# EAGLE design A13-SOM-WIFI_Rev_B (EAGLE 4.16)
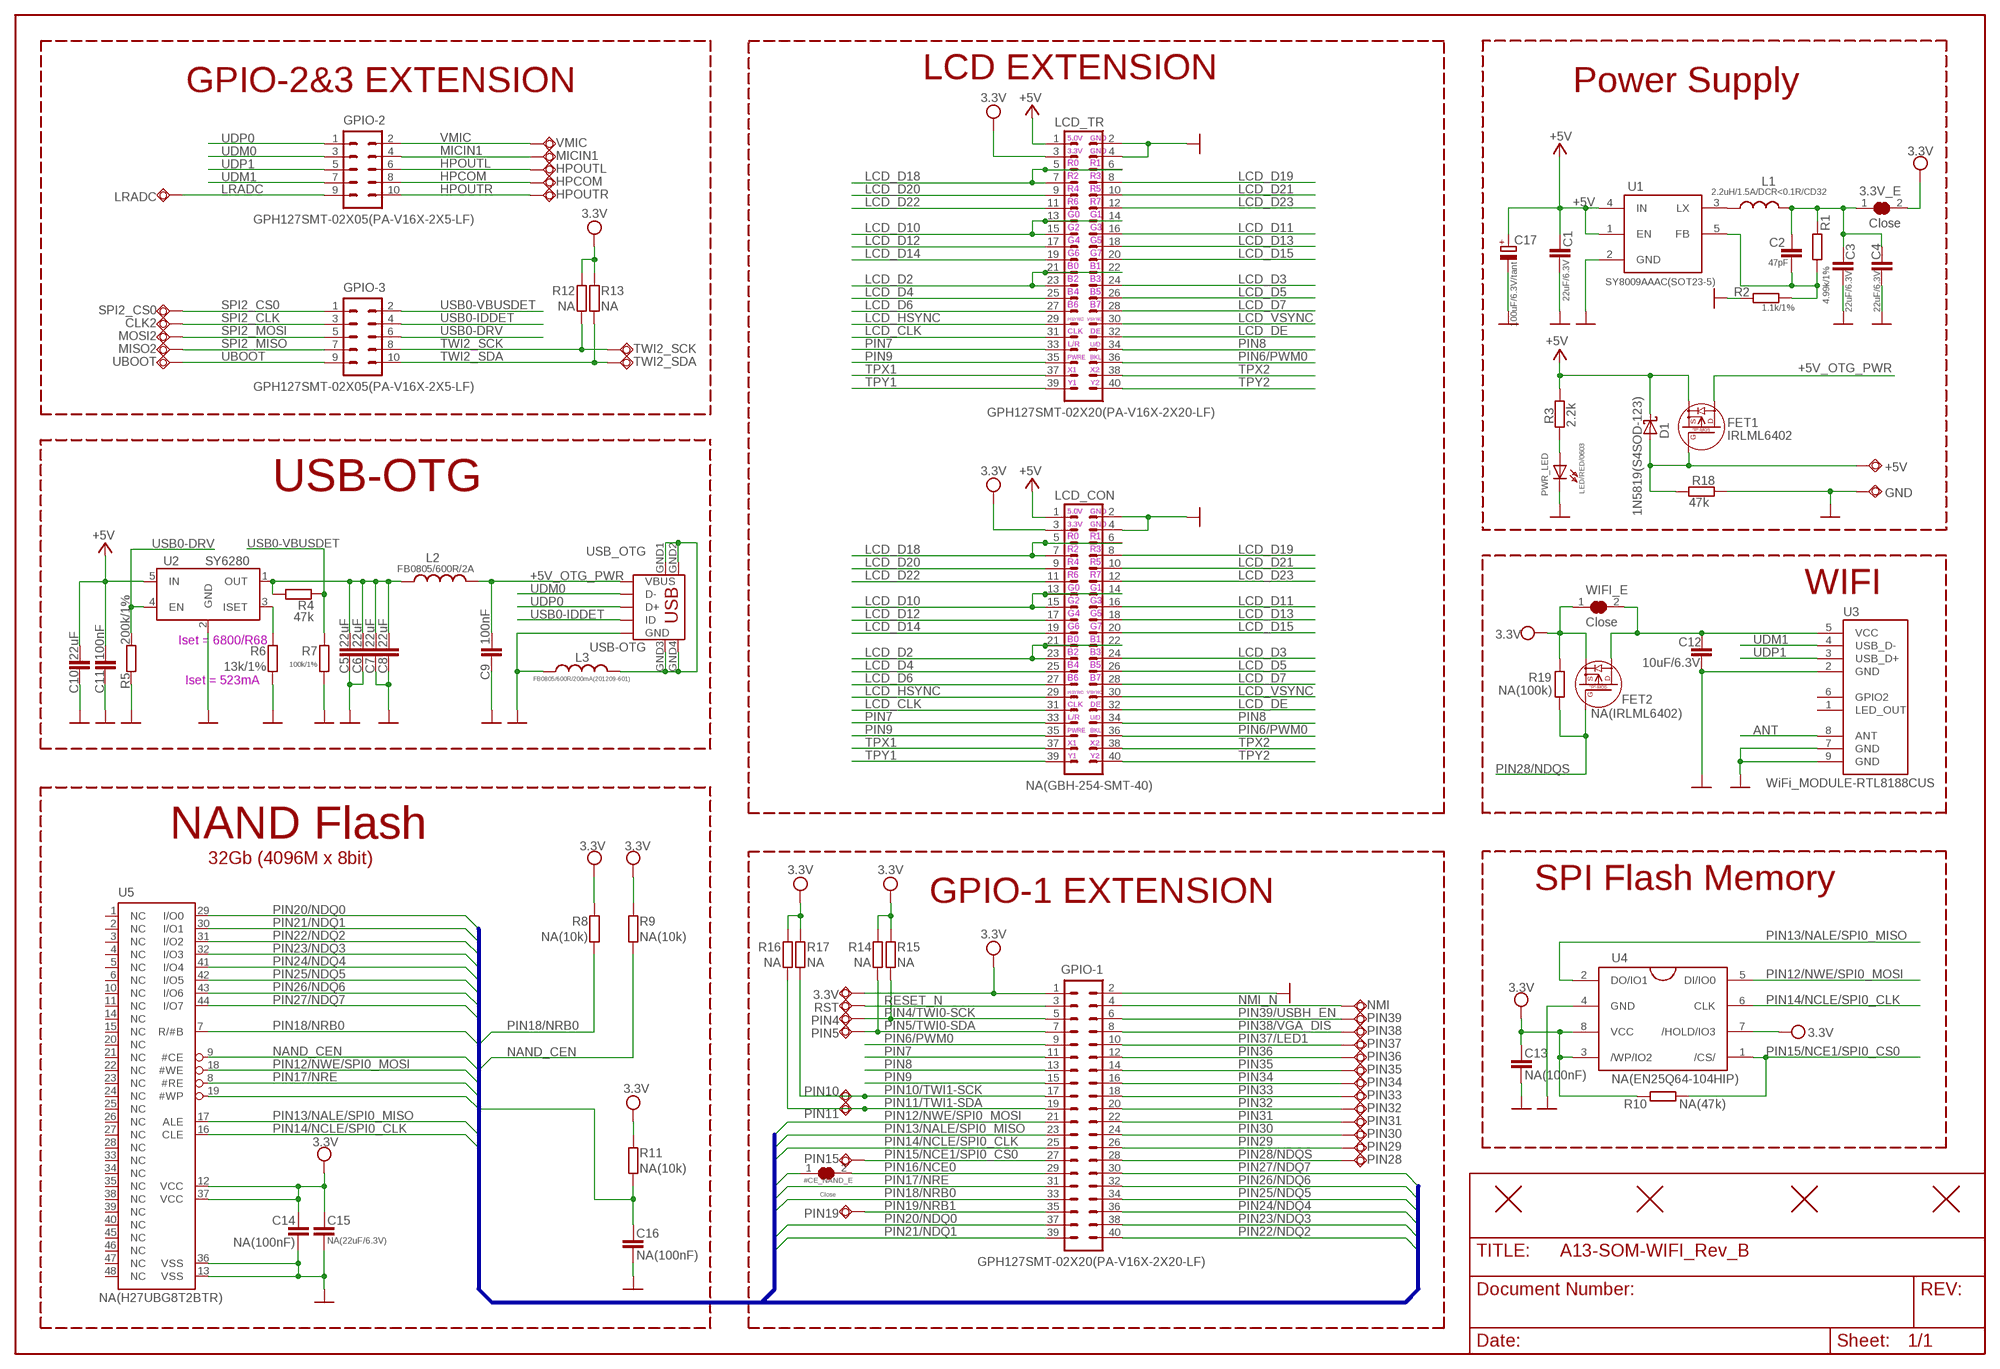
[diagram p0: schematic, sheet 1]

## Parts
3.3V  TESTPAD3  [TEST_PAD40/70/SQUARE]
3.3V_E  Close  SJSJ_1_SMALLER_CLOSE  [SJ_1_SMALLER_CLOSE]
#CE_NAND_E  Close  SJSJ_1_SMALLER_CLOSE  [SJ_1_SMALLER_CLOSE]
+5V  TESTPAD3  [TEST_PAD40/70/SQUARE]
C1  22uF/6.3V  C-EUC0603_DWS  [C0603_DWS]
C2  47pF  C-EUC0603_DWS  [C0603_DWS]
C3  22uF/6.3V  C-EUC0603_DWS  [C0603_DWS]
C4  22uF/6.3V  C-EUC0603_DWS  [C0603_DWS]
C5  22uF  C-EUC0603_DWS  [C0603_DWS]
C6  22uF  C-EUC0603_DWS  [C0603_DWS]
C7  22uF  C-EUC0603_DWS  [C0603_DWS]
C8  22uF  C-EUC0603_DWS  [C0603_DWS]
C9  100nF  C-EUC0603_DWS  [C0603_DWS]
C10  22uF  C-EUC0603_DWS  [C0603_DWS]
C11  100nF  C-EUC0603_DWS  [C0603_DWS]
C12  10uF/6.3V  C-EUC0603_DWS  [C0603_DWS]
C13  NA(100nF)  C-EUC0603_DWS  [C0603_DWS]
C14  NA(100nF)  C-EUC0603_DWS  [C0603_DWS]
C15  NA(22uF/6.3V)  C-EUC0603_DWS  [C0603_DWS]
C16  NA(100nF)  C-EUC0603_DWS  [C0603_DWS]
C17  100uF/6.3V/tant  CPOL-EUCT7343  [CT7343]
CLK2  TESTPAD3  [TEST_PAD40/70/SQUARE]
D1  1N5819(S4SOD-123)  SCHOTKKY7.62SS-1N5819(S4SOD-123)  [SOD-123]
FET1  IRLML6402  P-MOS+DIODIRLML6402  [SOT23]
FET2  NA(IRLML6402)  P-MOS+DIODIRLML6402  [SOT23]
FID1  FIDUCIAL  [FIDUCIAL-1X3]
FID2  FIDUCIAL  [FIDUCIAL-1X3]
FID3  FIDUCIAL  [FIDUCIAL-1X3]
FID4  FIDUCIAL  [FIDUCIAL-1X3]
GND  TESTPAD3  [TEST_PAD40/70/SQUARE]
GPIO-1  GPH127SMT-02X20(PA-V16X-2X20-LF)  ML40-GPH127SMT-02X20(PA-V16X-2X20-LF)  [GPH127SMT-02X20(PA-V16X-2X20-LF)]
GPIO-2  GPH127SMT-02X05(PA-V16X-2X5-LF)  ML10-GPH127SMT-02X05(PA-V16X-2X5-LF)  [GPH127SMT-02X05(PA-V16X-2X5-LF)]
GPIO-3  GPH127SMT-02X05(PA-V16X-2X5-LF)  ML10-GPH127SMT-02X05(PA-V16X-2X5-LF)  [GPH127SMT-02X05(PA-V16X-2X5-LF)]
HPCOM  TESTPAD3  [TEST_PAD40/70/SQUARE]
HPOUTL  TESTPAD3  [TEST_PAD40/70/SQUARE]
HPOUTR  TESTPAD3  [TEST_PAD40/70/SQUARE]
L1  2.2uH/1.5A/DCR<0.1R/CD32  L-CD32  [CD32]
L2  FB0805/600R/2A  L-USL0805_5MIL_DWS  [L0805_5MIL_DWS]
L3  FB0805/600R/200mA(201209-601)  L-USL0805_5MIL_DWS  [L0805_5MIL_DWS]
LCD_CON  NA(GBH-254-SMT-40)  ML40-GBH-254-SMT-40  [ML40-MALE(GBH-254-SMT-40)]
LCD_TR  GPH127SMT-02X20(PA-V16X-2X20-LF)  ML40-GPH127SMT-02X20(PA-V16X-2X20-LF)  [GPH127SMT-02X20(PA-V16X-2X20-LF)]
LRADC  TESTPAD3  [TEST_PAD40/70/SQUARE]
MICIN1  TESTPAD3  [TEST_PAD40/70/SQUARE]
MISO2  TESTPAD3  [TEST_PAD40/70/SQUARE]
MOSI2  TESTPAD3  [TEST_PAD40/70/SQUARE]
NMI  TESTPAD3  [TEST_PAD40/70/SQUARE]
PIN4  TESTPAD3  [TEST_PAD40/70/SQUARE]
PIN5  TESTPAD3  [TEST_PAD40/70/SQUARE]
PIN10  TESTPAD3  [TEST_PAD40/70/SQUARE]
PIN11  TESTPAD3  [TEST_PAD40/70/SQUARE]
PIN15  TESTPAD3  [TEST_PAD40/70/SQUARE]
PIN19  TESTPAD3  [TEST_PAD40/70/SQUARE]
PIN28  TESTPAD3  [TEST_PAD40/70/SQUARE]
PIN29  TESTPAD3  [TEST_PAD40/70/SQUARE]
PIN30  TESTPAD3  [TEST_PAD40/70/SQUARE]
PIN31  TESTPAD3  [TEST_PAD40/70/SQUARE]
PIN32  TESTPAD3  [TEST_PAD40/70/SQUARE]
PIN33  TESTPAD3  [TEST_PAD40/70/SQUARE]
PIN34  TESTPAD3  [TEST_PAD40/70/SQUARE]
PIN35  TESTPAD3  [TEST_PAD40/70/SQUARE]
PIN36  TESTPAD3  [TEST_PAD40/70/SQUARE]
PIN37  TESTPAD3  [TEST_PAD40/70/SQUARE]
PIN38  TESTPAD3  [TEST_PAD40/70/SQUARE]
PIN39  TESTPAD3  [TEST_PAD40/70/SQUARE]
PWR_LED  LED/RED/0603  LED0603DWS  [LED-0603]
R1  4.99k/1%  R-EU_R0603_5MIL_DWS  [R0603_5MIL_DWS]
R2  1.1k/1%  R-EU_R0603_5MIL_DWS  [R0603_5MIL_DWS]
R3  2.2k  R-EU_R0603_5MIL_DWS  [R0603_5MIL_DWS]
R4  47k  R-EU_R0603_5MIL_DWS  [R0603_5MIL_DWS]
R5  200k/1%  R-EU_R0603_5MIL_DWS  [R0603_5MIL_DWS]
R6  13k/1%  R-EU_R0603_5MIL_DWS  [R0603_5MIL_DWS]
R7  100k/1%  R-EU_R0603_5MIL_DWS  [R0603_5MIL_DWS]
R8  NA(10k)  R-EU_R0603_5MIL_DWS  [R0603_5MIL_DWS]
R9  NA(10k)  R-EU_R0603_5MIL_DWS  [R0603_5MIL_DWS]
R10  NA(47k)  R-EU_R0603_5MIL_DWS  [R0603_5MIL_DWS]
R11  NA(10k)  R-EU_R0603_5MIL_DWS  [R0603_5MIL_DWS]
R12  NA  R-EU_R0603_5MIL_DWS  [R0603_5MIL_DWS]
R13  NA  R-EU_R0603_5MIL_DWS  [R0603_5MIL_DWS]
R14  NA  R-EU_R0603_5MIL_DWS  [R0603_5MIL_DWS]
R15  NA  R-EU_R0603_5MIL_DWS  [R0603_5MIL_DWS]
R16  NA  R-EU_R0603_5MIL_DWS  [R0603_5MIL_DWS]
R17  NA  R-EU_R0603_5MIL_DWS  [R0603_5MIL_DWS]
R18  47k  R-EU_R0603_5MIL_DWS  [R0603_5MIL_DWS]
R19  NA(100k)  R-EU_R0603_5MIL_DWS  [R0603_5MIL_DWS]
RST  TESTPAD3  [TEST_PAD40/70/SQUARE]
SPI2_CS0  TESTPAD3  [TEST_PAD40/70/SQUARE]
TWI2_SCK  TESTPAD3  [TEST_PAD40/70/SQUARE]
TWI2_SDA  TESTPAD3  [TEST_PAD40/70/SQUARE]
U1  SY8009AAAC(SOT23-5)  SY8008  [SOT23-5]
U2  SY6280  [SOT23-5]
U3  WiFi_MODULE-RTL8188CUS  WM294_WIFI_802_11_N  [PCB_WIFI]
U4  NA(EN25Q64-104HIP)  W25Q16BVSSIG  [SO8_ATMEL_FLASH]
U5  NA(H27UBG8T2BTR)  H27UBG8T2A  [TSOP48]
UBOOT  TESTPAD3  [TEST_PAD40/70/SQUARE]
USB_OTG  USB-OTG  MINI_USB9  [USB_MINI_9PIN]
VMIC  TESTPAD3  [TEST_PAD40/70/SQUARE]
WIFI_E  Close  SJSJ_1_SMALLER_CLOSE  [SJ_1_SMALLER_CLOSE]

## Nets
+5V: C1.1 C10.1 C11.1 C17.+ D1.C FET1.2(S) LCD_CON.1 LCD_TR.1 R3.1 U1.1(EN) U1.4(IN) U2.5(IN)
+5V_OTG_PWR: C9.1 FET1.3(D) L2.1 USB_OTG.VBUS
ANT: U3.8(ANT)
GND [PWR]: C1.2 C3.2 C4.2 C5.2 C6.2 C7.2 C8.2 C9.2 C10.2 C11.2 C12.2 C13.2 C14.1 C15.1 C16.1 C17.- GND.P$1(PP) GPIO-1.2 L3.1 LCD_CON.2 LCD_CON.4 LCD_TR.2 LCD_TR.4 PWR_LED.C R2.2 R5.1 R6.1 R7.1 R18.1 U1.2(GND) U2.2(GND) U3.2(GND) U3.7(GND) U3.9(GND) U4.4(GND) U5.13(VSS) U5.36(VSS) USB_OTG.GND
HPCOM: GPIO-2.8 HPCOM.P$1(PP)
HPOUTL: GPIO-2.6 HPOUTL.P$1(PP)
HPOUTR: GPIO-2.10 HPOUTR.P$1(PP)
LCD_CLK: LCD_CON.31 LCD_TR.31
LCD_D2: LCD_CON.21 LCD_CON.22 LCD_CON.23 LCD_TR.21 LCD_TR.22 LCD_TR.23
LCD_D3: LCD_CON.24 LCD_TR.24
LCD_D4: LCD_CON.25 LCD_TR.25
LCD_D5: LCD_CON.26 LCD_TR.26
LCD_D6: LCD_CON.27 LCD_TR.27
LCD_D7: LCD_CON.28 LCD_TR.28
LCD_D10: LCD_CON.13 LCD_CON.14 LCD_CON.15 LCD_TR.13 LCD_TR.14 LCD_TR.15
LCD_D11: LCD_CON.16 LCD_TR.16
LCD_D12: LCD_CON.17 LCD_TR.17
LCD_D13: LCD_CON.18 LCD_TR.18
LCD_D14: LCD_CON.19 LCD_TR.19
LCD_D15: LCD_CON.20 LCD_TR.20
LCD_D18: LCD_CON.5 LCD_CON.6 LCD_CON.7 LCD_TR.5 LCD_TR.6 LCD_TR.7
LCD_D19: LCD_CON.8 LCD_TR.8
LCD_D20: LCD_CON.9 LCD_TR.9
LCD_D21: LCD_CON.10 LCD_TR.10
LCD_D22: LCD_CON.11 LCD_TR.11
LCD_D23: LCD_CON.12 LCD_TR.12
LCD_DE: LCD_CON.32 LCD_TR.32
LCD_HSYNC: LCD_CON.29 LCD_TR.29
LCD_VSYNC: LCD_CON.30 LCD_TR.30
LRADC: GPIO-2.9 LRADC.P$1(PP)
MICIN1: GPIO-2.4 MICIN1.P$1(PP)
N$1: +5V.P$1(PP) D1.A FET1.1(G) R18.2
N$2 [PWR]: C12.1 FET2.3(D) U3.5(VCC) WIFI_E.2
N$16: C5.1 C6.1 C7.1 C8.1 L2.2 R4.2 U2.1(OUT)
N$64: L1.1 U1.3(LX)
N$65: 3.3V_E.1 C2.1 C3.1 C4.1 L1.2 R1.1
N$66: C2.2 R1.2 R2.1 U1.5(FB)
N$99: R6.2 U2.3(ISET)
N$124: C16.2 R11.2 U5.19(#WP)
N$129: PWR_LED.A R3.2
N$266: L3.2 USB_OTG.GND1 USB_OTG.GND2 USB_OTG.GND3 USB_OTG.GND4
NAND_CEN: #CE_NAND_E.1 R9.2 U5.9(#CE)
NMI_N: GPIO-1.4 NMI.P$1(PP)
PIN4/TWI0-SCK: GPIO-1.5 PIN4.P$1(PP) R15.1
PIN5/TWI0-SDA: GPIO-1.7 PIN5.P$1(PP) R14.1
PIN6/PWM0: GPIO-1.9 LCD_CON.36 LCD_TR.36
PIN7: GPIO-1.11 LCD_CON.33 LCD_TR.33
PIN8: GPIO-1.13 LCD_CON.34 LCD_TR.34
PIN9: GPIO-1.15 LCD_CON.35 LCD_TR.35
PIN10/TWI1-SCK: GPIO-1.17 PIN10.P$1(PP) R17.1
PIN11/TWI1-SDA: GPIO-1.19 PIN11.P$1(PP) R16.1
PIN12/NWE/SPI0_MOSI: GPIO-1.21 U4.5(DI/IO0) U5.18(#WE)
PIN13/NALE/SPI0_MISO: GPIO-1.23 U4.2(DO/IO1) U5.17(ALE)
PIN14/NCLE/SPI0_CLK: GPIO-1.25 U4.6(CLK) U5.16(CLE)
PIN15/NCE1/SPI0_CS0: GPIO-1.27 PIN15.P$1(PP) R10.2 U4.1(/CS/)
PIN16/NCE0: #CE_NAND_E.2 GPIO-1.29
PIN17/NRE: GPIO-1.31 U5.8(#RE)
PIN18/NRB0: GPIO-1.33 R8.2 U5.7(R/#B)
PIN19/NRB1: GPIO-1.35 PIN19.P$1(PP)
PIN20/NDQ0: GPIO-1.37 U5.29(I/O0)
PIN21/NDQ1: GPIO-1.39 U5.30(I/O1)
PIN22/NDQ2: GPIO-1.40 U5.31(I/O2)
PIN23/NDQ3: GPIO-1.38 U5.32(I/O3)
PIN24/NDQ4: GPIO-1.36 U5.41(I/O4)
PIN25/NDQ5: GPIO-1.34 U5.42(I/O5)
PIN26/NDQ6: GPIO-1.32 U5.43(I/O6)
PIN27/NDQ7: GPIO-1.30 U5.44(I/O7)
PIN28/NDQS: FET2.1(G) GPIO-1.28 PIN28.P$1(PP) R19.2
PIN29: GPIO-1.26 PIN29.P$1(PP)
PIN30: GPIO-1.24 PIN30.P$1(PP)
PIN31: GPIO-1.22 PIN31.P$1(PP)
PIN32: GPIO-1.20 PIN32.P$1(PP)
PIN33: GPIO-1.18 PIN33.P$1(PP)
PIN34: GPIO-1.16 PIN34.P$1(PP)
PIN35: GPIO-1.14 PIN35.P$1(PP)
PIN36: GPIO-1.12 PIN36.P$1(PP)
PIN37/LED1 [PWR]: GPIO-1.10 PIN37.P$1(PP)
PIN38/VGA_DIS: GPIO-1.8 PIN38.P$1(PP)
PIN39/USBH_EN [PWR]: GPIO-1.6 PIN39.P$1(PP)
RESET_N: GPIO-1.3 RST.P$1(PP)
SPI2_CLK: CLK2.P$1(PP) GPIO-3.3
SPI2_CS0: GPIO-3.1 SPI2_CS0.P$1(PP)
SPI2_MISO: GPIO-3.7 MISO2.P$1(PP)
SPI2_MOSI: GPIO-3.5 MOSI2.P$1(PP)
TPX1: LCD_CON.37 LCD_TR.37
TPX2: LCD_CON.38 LCD_TR.38
TPY1: LCD_CON.39 LCD_TR.39
TPY2: LCD_CON.40 LCD_TR.40
TWI2_SCK: GPIO-3.8 R12.1 TWI2_SCK.P$1(PP)
TWI2_SDA: GPIO-3.10 R13.1 TWI2_SDA.P$1(PP)
UBOOT: GPIO-3.9 UBOOT.P$1(PP)
UDM0: GPIO-2.3 USB_OTG.D-
UDM1: GPIO-2.7 U3.4(USB_D-)
UDP0: GPIO-2.1 USB_OTG.D+
UDP1: GPIO-2.5 U3.3(USB_D+)
USB0-DRV: GPIO-3.6 R5.2 U2.4(EN)
USB0-IDDET: GPIO-3.4 USB_OTG.ID
USB0-VBUSDET: GPIO-3.2 R4.1 R7.2
VCC [PWR]: 3.3V.P$1(PP) 3.3V_E.2 C13.1 C14.2 C15.2 FET2.2(S) GPIO-1.1 LCD_CON.3 LCD_TR.3 R8.1 R9.1 R10.1 R11.1 R12.2 R13.2 R14.2 R15.2 R16.2 R17.2 R19.1 U4.3(/WP/IO2) U4.7(/HOLD/IO3) U4.8(VCC) U5.12(VCC) U5.37(VCC) WIFI_E.1 ; supply symbol labelled 3.3V
VMIC: GPIO-2.2 VMIC.P$1(PP)
Unconnected: U3.1(LED_OUT) U3.6(GPIO2) U5.1(NC) U5.2(NC) U5.3(NC) U5.4(NC) U5.5(NC) U5.6(NC) U5.10(NC) U5.11(NC) U5.14(NC) U5.15(NC) U5.20(NC) U5.21(NC) U5.22(NC) U5.23(NC) U5.24(NC) U5.25(NC) U5.26(NC) U5.27(NC) U5.28(NC) U5.33(NC) U5.34(NC) U5.35(NC) U5.38(NC) U5.39(NC) U5.40(NC) U5.45(NC) U5.46(NC) U5.47(NC) U5.48(NC)

## Buses
NDQ[0..7],NWE,NALE,NCLE,NCE0,NCE1,NRE,NRB[0..1],NDQS

## Notes on the sheet
- LCD EXTENSION
- GPIO-2&3 EXTENSION | Power Supply
- 5.0V | GND
- 3.3V | GND
- R0 | R1
- R2 | R3
- R4 | R5
- R6 | R7
- G0 | G1
- G2 | G3
- G4 | G5
- G6 | G7
- B0 | B1
- B2 | B3
- B4 | B5
- B6 | B7
- HSYNC | VSYNC
- CLK | DE
- L/R | U/D
- PWRE | BKL
- X1 | X2
- Y1 | Y2
- USB-OTG
- 5.0V | GND
- 3.3V | GND
- R0 | R1
- R2 | R3
- R4 | R5
- R6 | R7
- G0 | G1
- WIFI
- G2 | G3
- G4 | G5
- G6 | G7
- Iset = 6800/R68 | B0 | B1
- B2 | B3
- B4 | B5
- B6 | B7
- Iset = 523mA
- HSYNC | VSYNC
- CLK | DE
- L/R | U/D
- PWRE | BKL
- X1 | X2
- Y1 | Y2
- NAND Flash
- 32Gb (4096M x 8bit)
- SPI Flash Memory
- GPIO-1 EXTENSION

## Library data of the parts
3.3V +5V CLK2 GND HPCOM HPOUTL HPOUTR LRADC MICIN1 MISO2 MOSI2 NMI PIN4 PIN5 PIN10 PIN11 PIN15 PIN19 PIN28-PIN39 RST SPI2_CS0 TWI2_SCK TWI2_SDA UBOOT VMIC = gogo:TESTPAD: drill 40mils, diameter 70mils
3.3V_E #CE_NAND_E WIFI_E = jumper:SJ: SMD solder JUMPER
C1-C16 = rcl:C-EU: CAPACITOR, European symbol
C17 = rcl:CPOL-EU: POLARIZED CAPACITOR, European symbol
D1 = gogo:SCHOTKKY7.62SS
FET1 FET2 = Penko:P-MOS+DIOD
FID1-FID4 = SparkFunEagle-6-6-07:FIDUCIAL: Fiducial Alignment Points Various fiducial points for machine vision alignment.
GPIO-1 LCD_CON LCD_TR = con-harting-ml:ML40: HARTING
GPIO-2 GPIO-3 = con-harting-ml:ML10: HARTING
L1 = OLIMEX_DISCRET:L
L2 L3 = rcl:L-US: INDUCTOR, American symbol
PWR_LED = DOUBLE-SIDE:LED
R1-R19 = rcl:R-EU_: RESISTOR, European symbol
U1 = OLIMEX_IC:SY8008
U2 = OLIMEX_IC:SY6280
U3 = OLIMEX_IC:WM294_WIFI_802_11_N
U4 = OLIMEX_IC:W25Q16BVSSIG
U5 = OLIMEX_IC:H27UBG8T2A
USB_OTG = OLIMEX_CONNECTORS:MINI_USB9

## Board
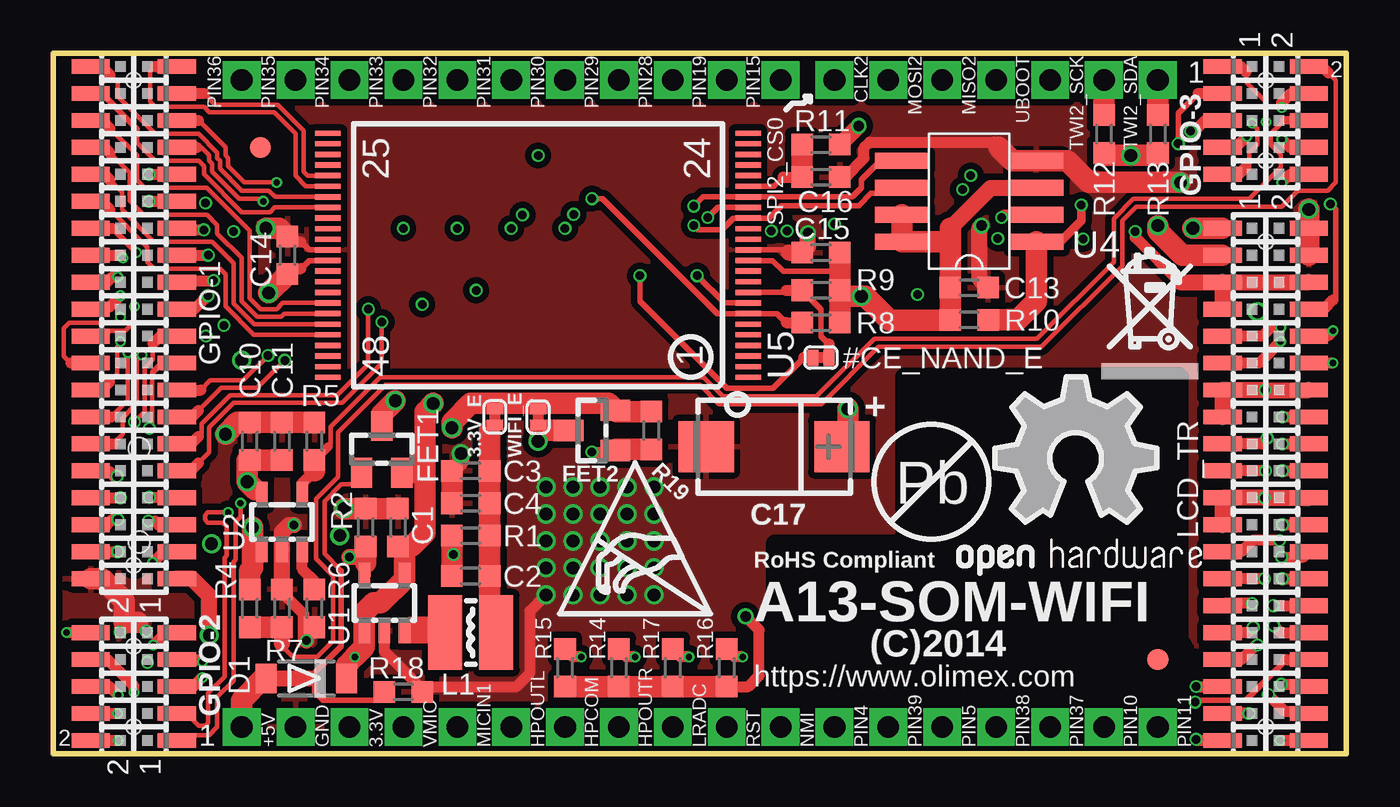
[diagram p1: board, top side]
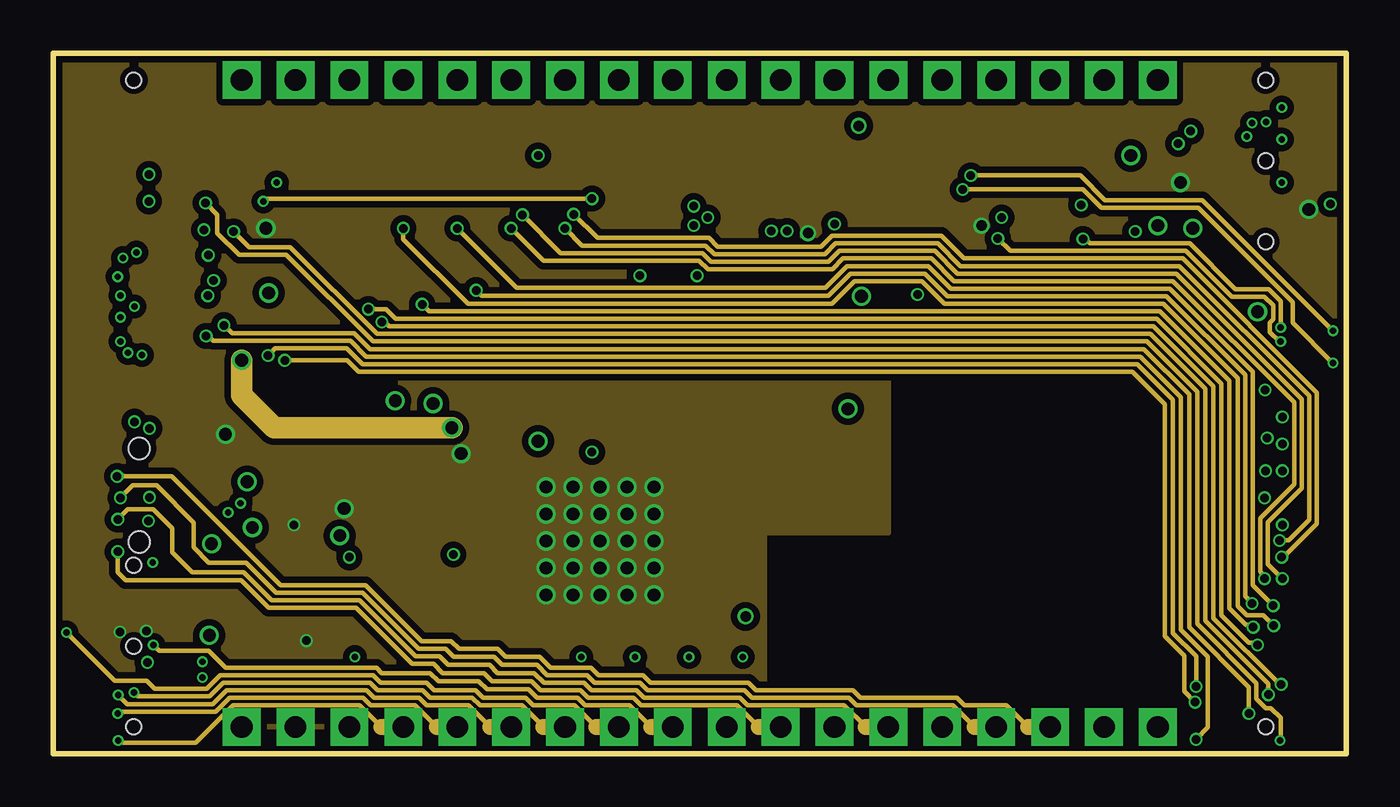
[diagram p2: board, inner layer Route2]
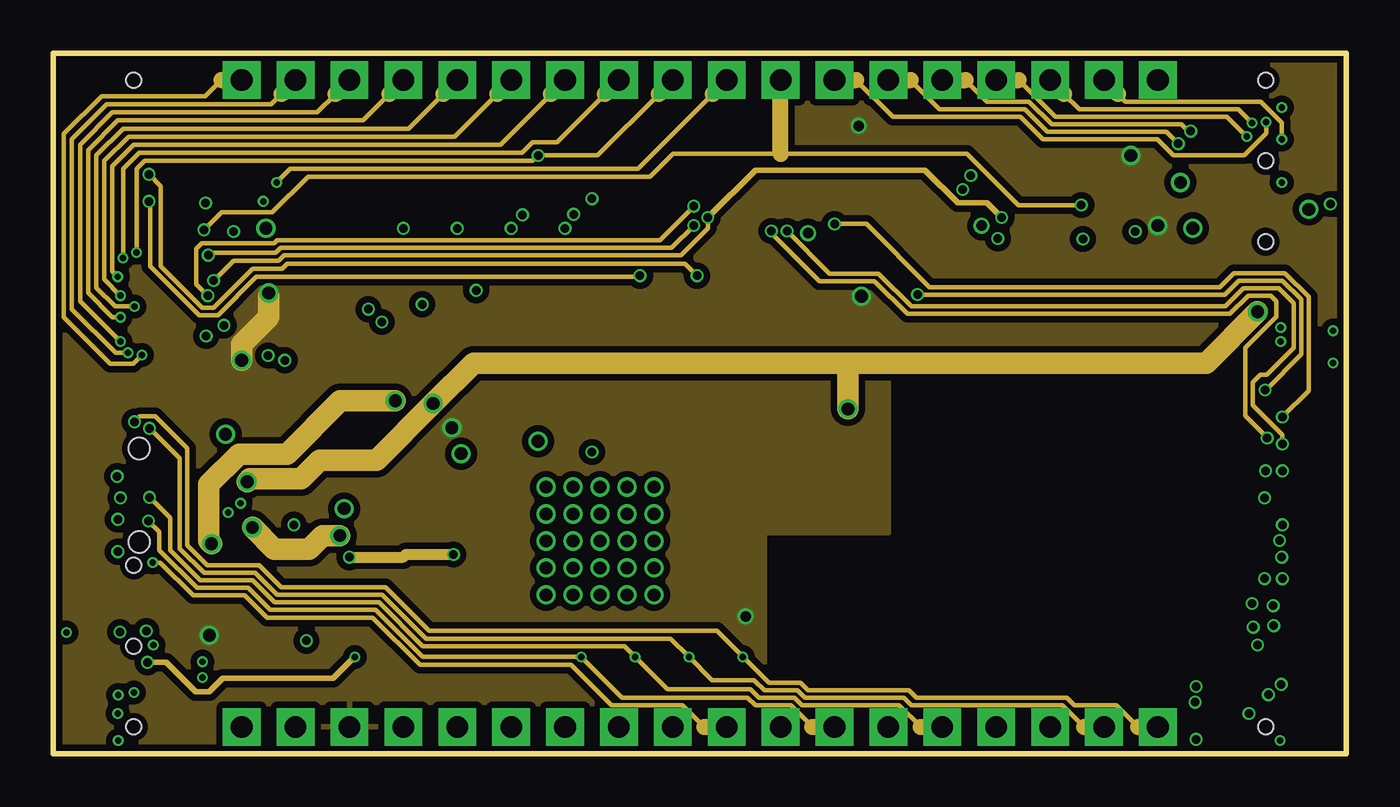
[diagram p3: board, inner layer Route15]
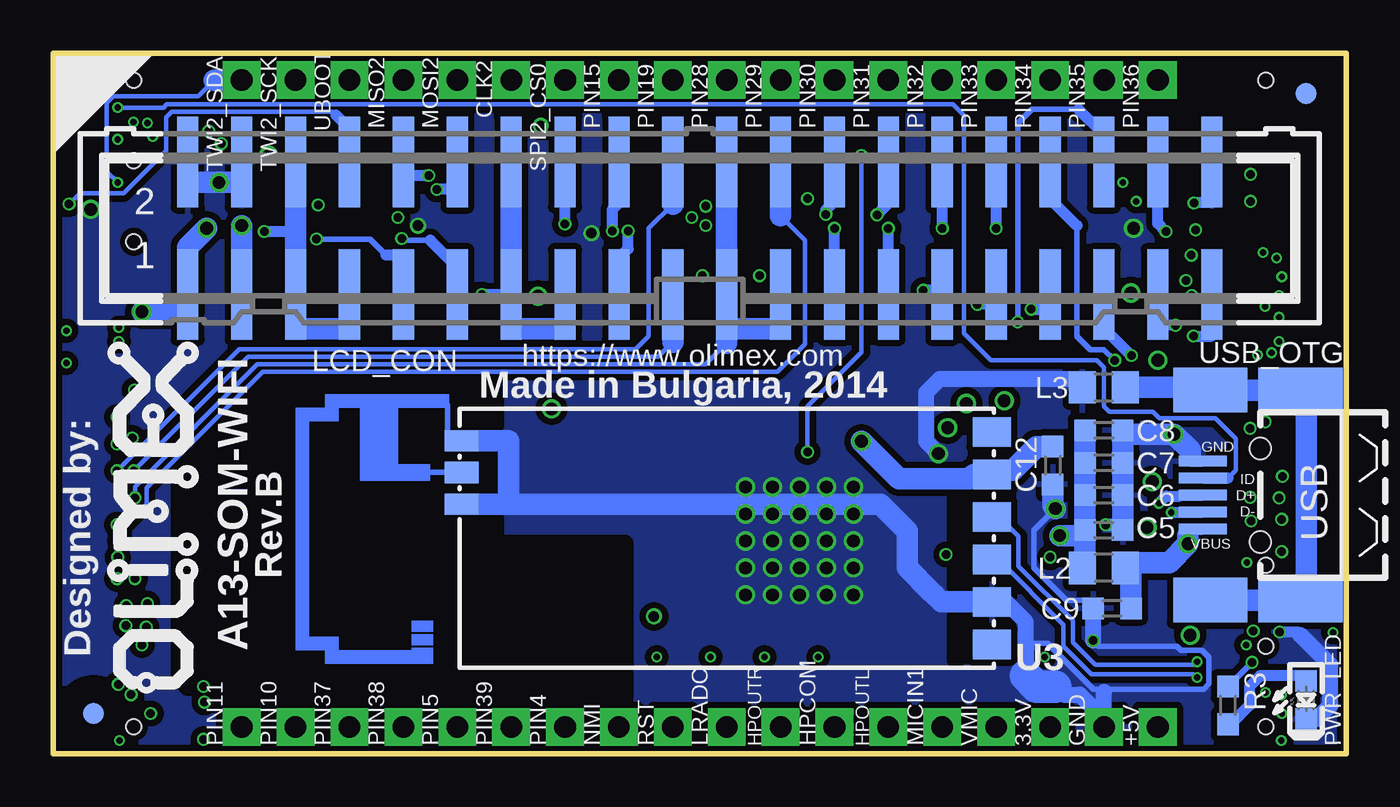
[diagram p4: board, bottom side, seen from below]

Size 60.96 x 33.02 mm. Coordinates in mm from the lower left corner, seen from the top.
Outline: 0,33.02 0,0 60.96,0 60.96,33.02 0,33.02
Copper layers (1*2*15*16): Top 0.035mm / dielectric 0.127mm / Route2 0.035mm / dielectric 1.2mm / Route15 0.035mm / dielectric 0.127mm / Bottom 0.035mm
Design rules "default": minimum track width 4.5mil, minimum drill 10mil, track to track 0.1321mm, track to pad 0.1321mm, pad to pad 0.1321mm, via to via 0.1321mm, smd to smd 1mil, copper to edge 10mil, drill to drill 8mil, minimum pad ring 6mil, minimum via ring 4mil, stop-mask expansion 4mil, vias tented up to drill 25mil, thermal gap 12mil
tRestrict: 6 lines
bRestrict: 17 lines

### Footprints (pad centres in the part's own frame; a part is rotated, then mirrored left to right if it is on the bottom)
TEST_PAD40/70/SQUARE = drill 1.016 pad 1.778 square: P$1 0,0
SJ_1_SMALLER_CLOSE = smd 0.508 x 0.762: 1 -0.381,0; 2 0.381,0
C0603_DWS = smd 1.016 x 1.016: 1 -0.889,0; 2 0.889,0
CT7343 = smd 2.6 x 2.4: + 3.2,0; - -3.2,0
SOD-123 = smd 1 x 1.4: A 1.9,0; C -1.9,0
SOT23 = smd 1.4 x 1: 1 1.1,-0.95; 2 1.1,0.95; 3 -1.1,0
FIDUCIAL-1X3 = smd 1 x 1: 1 0,0
GPH127SMT-02X20(PA-V16X-2X20-LF) = smd 0.7 x 1.8: 1 -12.065,-2.032; 2 -12.065,2.032; 3 -10.795,-2.032; 4 -10.795,2.032; 5 -9.525,-2.032; 6 -9.525,2.032; 7 -8.255,-2.032; 8 -8.255,2.032; 9 -6.985,-2.032; 10 -6.985,2.032; 11 -5.715,-2.032; 12 -5.715,2.032; 13 -4.445,-2.032; 14 -4.445,2.032; 15 -3.175,-2.032; 16 -3.175,2.032; 17 -1.905,-2.032; 18 -1.905,2.032; 19 -0.635,-2.032; 20 -0.635,2.032; 21 0.635,-2.032; 22 0.635,2.032; 23 1.905,-2.032; 24 1.905,2.032; 25 3.175,-2.032; 26 3.175,2.032; 27 4.445,-2.032; 28 4.445,2.032; 29 5.715,-2.032; 30 5.715,2.032; 31 6.985,-2.032; 32 6.985,2.032; 33 8.255,-2.032; 34 8.255,2.032; 35 9.525,-2.032; 36 9.525,2.032; 37 10.795,-2.032; 38 10.795,2.032; 39 12.065,-2.032; 40 12.065,2.032 | hole 0.7: -11.43,0; 11.43,0
GPH127SMT-02X05(PA-V16X-2X5-LF) = smd 0.7 x 1.8: 1 -2.54,-2.032; 2 -2.54,2.032; 3 -1.27,-2.032; 4 -1.27,2.032; 5 0,-2.032; 6 0,2.032; 7 1.27,-2.032; 8 1.27,2.032; 9 2.54,-2.032; 10 2.54,2.032 | hole 0.7: -1.905,0; 1.905,0
CD32 = smd 1.6 x 3.5: 1 -1.2,0; 2 1.2,0
L0805_5MIL_DWS = smd 1.27 x 1.524: 1 -1.016,0; 2 1.016,0
ML40-MALE(GBH-254-SMT-40) = smd 1 x 4.25: 1 -24.13,-3.125; 2 -24.13,3.125; 3 -21.59,-3.125; 4 -21.59,3.125; 5 -19.05,-3.125; 6 -19.05,3.125; 7 -16.51,-3.125; 8 -16.51,3.125; 9 -13.97,-3.125; 10 -13.97,3.125; 11 -11.43,-3.125; 12 -11.43,3.125; 13 -8.89,-3.125; 14 -8.89,3.125; 15 -6.35,-3.125; 16 -6.35,3.125; 17 -3.81,-3.125; 18 -3.81,3.125; 19 -1.27,-3.125; 20 -1.27,3.125; 21 1.27,-3.125; 22 1.27,3.125; 23 3.81,-3.125; 24 3.81,3.125; 25 6.35,-3.125; 26 6.35,3.125; 27 8.89,-3.125; 28 8.89,3.125; 29 11.43,-3.125; 30 11.43,3.125; 31 13.97,-3.125; 32 13.97,3.125; 33 16.51,-3.125; 34 16.51,3.125; 35 19.05,-3.125; 36 19.05,3.125; 37 21.59,-3.125; 38 21.59,3.125; 39 24.13,-3.125; 40 24.13,3.125
LED-0603 = smd 1.016 x 1.016: A 0.889,0; C -0.889,0
R0603_5MIL_DWS = smd 1.016 x 1.016: 1 -0.889,0; 2 0.889,0
SOT23-5 = smd 1.2 x 0.55: 1 1.3,-0.95; 2 1.3,0; 3 1.3,0.95; 4 -1.3,0.95; 5 -1.3,-0.95
PCB_WIFI = smd 1.8 x 1.4: 1 12.5,-5; 2 12.5,-3; 3 12.5,-1; 4 12.5,1; 5 12.5,3; 6 12.5,5 | smd 1.6 x 1: 7 -12.5,4.6; 8 -12.5,3.1; 9 -12.5,1.6
SO8_ATMEL_FLASH = smd 0.762 x 2.54: 1 -1.905,-3.175; 2 -0.635,-3.175; 3 0.635,-3.175; 4 1.905,-3.175; 5 1.905,3.175; 6 0.635,3.175; 7 -0.635,3.175; 8 -1.905,3.175
TSOP48 = smd 1.2 x 0.25: 1 -9.9,5.75; 2 -9.9,5.25; 3 -9.9,4.75; 4 -9.9,4.25; 5 -9.9,3.75; 6 -9.9,3.25; 7 -9.9,2.75; 8 -9.9,2.25; 9 -9.9,1.75; 10 -9.9,1.25; 11 -9.9,0.75; 12 -9.9,0.25; 13 -9.9,-0.25; 14 -9.9,-0.75; 15 -9.9,-1.25; 16 -9.9,-1.75; 17 -9.9,-2.25; 18 -9.9,-2.75; 19 -9.9,-3.25; 20 -9.9,-3.75; 21 -9.9,-4.25; 22 -9.9,-4.75; 23 -9.9,-5.25; 24 -9.9,-5.75; 25 9.9,-5.75; 26 9.9,-5.25; 27 9.9,-4.75; 28 9.9,-4.25; 29 9.9,-3.75; 30 9.9,-3.25; 31 9.9,-2.75; 32 9.9,-2.25; 33 9.9,-1.75; 34 9.9,-1.25; 35 9.9,-0.75; 36 9.9,-0.25; 37 9.9,0.25; 38 9.9,0.75; 39 9.9,1.25; 40 9.9,1.75; 41 9.9,2.25; 42 9.9,2.75; 43 9.9,3.25; 44 9.9,3.75; 45 9.9,4.25; 46 9.9,4.75; 47 9.9,5.25; 48 9.9,5.75
USB_MINI_9PIN = smd 2.25 x 0.5: D+ 2.706,0; D- 2.706,0.8; GND 2.706,-1.6; ID 2.706,-0.8; VBUS 2.706,1.6 | smd 4 x 2.1: GND1 -1.9,4.95; GND3 -1.9,-4.95 | smd 3.5 x 2.1: GND2 2.35,4.95; GND4 2.35,-4.95 | hole 1: 0,2.2; 0,-2.2

### Placement (x,y rotation side)
3.3V  13.97,1.27 0 top
3.3V_E  20.83,15.88 90 top
#CE_NAND_E  36.2,18.67 180 top
+5V  8.89,1.27 0 top
C1  16.26,10.67 90 top
C2  19.68,8.38 180 top
C3  19.68,13.34 180 top
C4  19.68,11.81 180 top
C5  11.43,10.54 0 bottom
C6  11.43,12.19 0 bottom
C7  11.43,13.72 0 bottom
C8  11.43,15.24 0 bottom
C9  11.05,6.86 180 bottom
C10  9.27,14.73 90 top
C11  10.79,14.73 90 top
C12  13.84,13.59 270 bottom
C13  43.18,21.97 0 top
C14  11.05,23.5 270 top
C15  36.2,23.62 0 top
C16  36.2,27.18 180 top
C17  33.99,14.48 0 top
CLK2  39.37,31.75 90 top
D1  11.94,3.56 180 top
FET1  15.49,14.35 270 top
FET2  25.4,15.24 0 top
FID1  59.05,1.91 180 bottom
FID2  1.91,31.11 0 bottom
FID3  52.07,4.45 180 top
FID4  9.78,28.57 180 top
GND  11.43,1.27 0 top
GPIO-1  3.81,20.32 90 top
GPIO-2  3.81,3.17 90 top
GPIO-3  57.15,29.84 270 top
HPCOM  24.13,1.27 270 top
HPOUTL  21.59,1.27 270 top
HPOUTR  26.67,1.27 270 top
L1  19.68,5.71 0 top
L2  11.43,8.76 180 bottom
L3  11.43,17.27 0 bottom
LCD_CON  30.48,24.77 0 bottom
LCD_TR  57.15,12.7 270 top
LRADC  29.21,1.27 270 top
MICIN1  19.05,1.27 270 top
MISO2  44.45,31.75 90 top
MOSI2  41.91,31.75 90 top
NMI  34.29,1.27 270 top
PIN4  36.83,1.27 90 top
PIN5  41.91,1.27 90 top
PIN10  49.53,1.27 90 top
PIN11  52.07,1.27 90 top
PIN15  34.29,31.75 90 top
PIN19  31.75,31.75 0 top
PIN28  29.21,31.75 270 top
PIN29  26.67,31.75 270 top
PIN30  24.13,31.75 270 top
PIN31  21.59,31.75 270 top
PIN32  19.05,31.75 270 top
PIN33  16.51,31.75 270 top
PIN34  13.97,31.75 270 top
PIN35  11.43,31.75 270 top
PIN36  8.89,31.75 270 top
PIN37  46.99,1.27 270 top
PIN38  44.45,1.27 270 top
PIN39  39.37,1.27 270 top
PWR_LED  1.91,2.54 90 bottom
R1  19.68,10.29 180 top
R2  14.73,10.67 90 top
R3  5.59,2.29 270 bottom
R4  9.27,6.86 90 top
R5  12.32,14.73 270 top
R6  12.32,6.86 90 top
R7  10.79,6.86 270 top
R8  36.2,20.32 180 top
R9  36.2,21.84 180 top
R10  43.18,20.45 0 top
R11  36.2,28.7 180 top
R12  49.53,29.21 270 top
R13  52.07,29.21 270 top
R14  26.67,4.06 270 top
R15  24.13,4.06 270 top
R16  31.75,4.06 270 top
R17  29.21,4.06 270 top
R18  16.51,2.92 180 top
R19  28.19,15.24 270 top
RST  31.75,1.27 90 top
SPI2_CS0  36.83,31.75 90 top
TWI2_SCK  49.53,31.75 90 top
TWI2_SDA  52.07,31.75 90 top
U1  15.62,7.11 270 top
U2  10.79,10.92 270 top
U3  29.21,10.16 0 bottom
U4  43.18,26.04 90 top
U5  22.86,23.5 180 top
U$5  [LOGO-OPENHARDWARE_8X8]  48.2,13.84 0 top
U$8  [OLIMEX1_V]  53.98,20.57 90 bottom
U$9  [PB]  41.4,12.83 0 top
U$10  [ESD_SYMBOL]  23.88,6.6 0 top
U$11  [RECYCLE_BIN1/8]  49.4,17.65 0 top
UBOOT  46.99,31.75 90 top
USB_OTG  4.06,12.19 180 bottom
VMIC  16.51,1.27 270 top
WIFI_E  22.86,15.88 270 top

### Tracks (layer width: path | path; a pad name or v marks a point on that pad's centre or on a via)
+5V  (via drill 0.3, 0.4, 0.6)
  Top 0.508: U2.5 9.75,12.22 9.53,12.45
  Top 0.762: 16.57,8.24 U1.4 | 15.11,7.11 15.44,7.11 | 16.57,9.78 16.51,9.78
  Top 1.016: 15.44,7.11 16.57,8.24 | 15.11,7.11 14.67,6.67 U1.1 14.67,5.02 v14.22,4.57 13.84,4.19 D1.C | C11.1 C10.1 9.14,13.84 v9.14,12.83 9.53,12.45 | v53.72,24.77 LCD_TR.1 | U1.4 16.57,9.78 16.89,9.78 17.53,10.41 17.53,13.25 | 16.51,9.78 C1.1 | 17.53,13.25 FET1.2 | 17.53,13.25 17.53,16.13 v17.91,16.51 | C17.+ 37.47,14.76 v37.47,16.26
  Route15 0.254: v4.45,4.32 5.33,4.32 6.73,2.92 7.37,2.92 8,3.56 13.21,3.56 v14.22,4.57
  Route15 1.016: v9.14,12.83 9.27,12.95 11.68,12.95 12.57,13.84 15.24,13.84 v17.91,16.51 19.81,18.41 37.47,18.41 | 37.47,18.41 54.36,18.41 v56.77,20.83 | 37.47,18.41 v37.47,16.26
  Bottom 0.254: v4.45,4.32 R3.1
  Bottom 1.016: v53.72,24.77 54.61,23.88 LCD_CON.1 54.61,20.83 v56.77,20.83
+5V_OTG_PWR  (via drill 0.6)
  Top 1.016: FET1.3 15.49,16 v16.13,16.64
  Route15 1.016: v7.47,9.91 7.34,10.03 7.34,12.7 8.76,14.12 11.02,14.12 13.54,16.64 v16.13,16.64
  Bottom 0.508: USB_OTG.VBUS 7.47,10.59 7.47,10.31
  Bottom 1.016: C9.1 10.16,8.76 L2.1 10.16,9.02 8.36,9.02 v7.47,9.91 7.47,10.31
ANT
  Bottom 0.254: U3.8 43.31,13.26
GND  (via drill 0.4, 0.5, 0.6)
  Top 0.254: U5.13 34.55,23.75 34.67,23.62 | U5.36 12.07,23.75 11.68,24.13
  Top 0.508: R6.1 11.81,5.97 11.81,6.58 10.79,7.59 R7.1 | v3.15,5.74 3.15,5.99 3.35,6.2 | 3.99,6.2 v4.39,5.79 | C16.1 37.34,27.18 38.23,28.07 38.23,28.57 38.48,28.83 44.32,28.83 44.58,28.57 | C14.1 11.3,24.13 11.68,24.13 | U1.2 15.62,4.83 17.4,3.05 R18.1 17.4,3.17 21.84,3.17 22.48,3.81 22.48,6.73 v23.24,7.49
  Top 0.762: R6.1 11.94,5.97 v11.94,5.33 | v11.35,10.79 11.12,10.79 10.79,10.46 U2.2 R7.1 | C3.2 19.23,13.77 v19.23,14.15 | C13.2 43.66,22.38 43.66,24.79 v43.76,24.89 | 34.67,23.62 C15.1 35.59,23.9 v35.59,24.54
  Top 1.016: C1.2 R2.2 v13.72,11.56 | C3.2 C4.2 | R5.1 C11.2 C10.2 8.69,15.62 v8.13,15.06 | 3.99,6.2 3.35,6.2 3.35,7.21 2.31,8.26 GPIO-1.2 | v53.14,26.92 48.82,26.92 47.8,27.94 U4.4 45.21,27.94 44.58,28.57 | v10.03,24.77 10.67,24.77 C14.1 | LCD_TR.4 LCD_TR.2 v59.18,25.65
  Bottom 0.254: U3.7 42.37,14.76 42.37,16.43 42.55,16.61 | C9.2 12.32,7.24 13.21,7.24 14.73,8.76 14.73,10.54 v13.72,11.56 | v11.94,5.33 11.68,5.08 8,5.08 7.8,4.88 6.81,4.88 6.48,4.55 6.48,3.3 6.73,3.05 11.94,3.05 14.1,5.21 15.11,5.21
  Bottom 0.508: USB_OTG.GND 7.37,13.79 7.37,14.1 | 2.18,5.61 2.31,5.74 v3.15,5.74
  Bottom 0.61: v11.35,10.79 10.54,10.79
  Bottom 0.762: U3.2 16.05,7.16 15.11,6.22 15.11,5.21 15.11,3.68 | 13.72,3.17 13.34,2.79 12.57,2.79 11.43,1.65 | v11.94,5.33 C9.2 | 2.18,5.61 0.76,4.19 0.76,2.29 1.4,1.65 PWR_LED.C | v19.23,14.15 19.81,14.73 19.81,17.02 19.18,17.65 12.83,17.65 L3.1 | 11.43,1.65 GND.P$1 | 11.43,1.65 11.43,2.92
  Bottom 1.016: 39.5,11.76 U3.9 | U3.7 39.5,14.76 39.5,11.76 | 39.5,11.76 21.97,11.76 20.7,10.49 20.7,8.76 19.56,7.62 | 19.56,7.62 19.43,7.49 | U3.2 19.1,7.16 19.56,7.62 | v13.72,11.56 13.84,11.68 C12.2 | C5.2 10.54,10.79 C6.2 C7.2 10.54,15.06 | 10.54,15.06 C8.2 | 7.37,14.1 7.37,14.3 v8.13,15.06 10.54,15.06 | LCD_CON.4 52.07,26.92 v53.14,26.92 54.61,26.92 LCD_CON.2
  Bottom 1.524: 15.11,3.68 14.61,3.17 13.72,3.17
  other vias: 23.24,12.57 24.51,12.57 25.78,12.57 27.05,12.57 28.32,12.57 23.24,11.3 24.51,11.3 25.78,11.3 27.05,11.3 28.32,11.3 23.24,10.03 24.51,10.03 25.78,10.03 27.05,10.03 28.32,10.03 23.24,8.76 24.51,8.76 25.78,8.76 27.05,8.76 28.32,8.76 24.51,7.49 25.78,7.49 27.05,7.49 28.32,7.49
  pour Route2 (isolate 0.305, rank 3): -7.62,-6.35 33.53,-6.35 33.53,10.41 39.37,10.41 39.37,17.78 50.8,17.78 50.8,-6.35 68.58,-6.35 68.58,40.64 -7.62,40.64
  pour Top (isolate 0.305, rank 2): -2.54,35.56 -2.54,-2.54 63.5,-2.54 63.5,35.56
  pour Bottom (isolate 0.305, rank 3): -5.08,-5.08 66.04,-5.08 66.04,38.1 -5.08,38.1
  pour Bottom (isolate 0.406): 15.24,17.14 49.91,17.14 50.16,16.89 50.16,3.17 15.24,3.17
HPCOM  (via drill 0.3)
  Top 0.508: GPIO-2.8 2.56,4.45 3.81,3.2 v3.81,2.9
  Route2 0.203: v3.81,2.9 3.99,2.72 7.39,2.72 8.03,3.35 14.94,3.35 15.29,3 17.42,3 17.78,2.64 19.76,2.64 20.12,2.29 22.1,2.29 23.11,1.27
  Route2 0.762: 23.11,1.27 HPCOM.P$1
HPOUTL  (via drill 0.3)
  Top 0.508: GPIO-2.6 2.67,3.17 v3.07,2.77
  Route2 0.203: v3.07,2.77 3.5,2.34 7.52,2.34 8.18,3 14.78,3 15.14,2.64 17.25,2.64 17.6,2.29 19.58,2.29 20.6,1.27
  Route2 0.762: 20.6,1.27 HPOUTL.P$1
HPOUTR  (via drill 0.3)
  Top 0.508: GPIO-2.10 v0.64,5.71
  Route2 0.203: 25.6,1.27 24.59,2.29 22.63,2.29 22.28,2.64 20.27,2.64 19.91,3 17.96,3 17.6,3.35 15.44,3.35 15.09,3.71 7.87,3.71 7.24,3.07 4.8,3.07 4.42,3.45 2.9,3.45 v0.64,5.71
  Route2 0.762: 25.6,1.27 HPOUTR.P$1
LCD_CLK  (via drill 0.4)
  Top 0.508: LCD_TR.31 56.31,5.71 v56.57,5.97
  Route2 0.203: v17.4,21.18 17.73,20.85 52.17,20.85 55.45,17.58 55.45,6.86 56.21,6.1 56.44,6.1 v56.57,5.97
  Bottom 0.508: LCD_CON.31 16.51,21.18 v17.4,21.18
LCD_D2  (via drill 0.4)
  Top 0.762: LCD_TR.23 LCD_TR.21 v57.1,12.06 LCD_TR.22
  Bottom 0.203: v57.1,12.06 57.1,12.6 51.33,18.36 30.2,18.36 29.21,19.36
  Bottom 1.016: LCD_CON.23 26.67,20.04 29.21,20.04 | LCD_CON.22 LCD_CON.21 29.21,20.04 | 29.21,20.04 29.21,19.36
LCD_D3  (via drill 0.4)
  Top 0.508: v57.94,10.79 LCD_TR.24
  Bottom 0.203: v57.94,10.79 57.5,10.79 56.54,11.76 56.54,12.55 51.08,18.01 26.82,18.01 25.53,19.3 25.53,24.21 26.67,25.35
  Bottom 1.016: 26.67,25.35 LCD_CON.24
LCD_D4  (via drill 0.4)
  Top 0.508: v57.81,10.06 56.54,10.06 56.01,9.53 LCD_TR.25
  Route2 0.203: v24.13,24.77 24.94,23.95 30.76,23.95 31.17,23.55 36.37,23.55 36.88,24.05 41.71,24.05 42.77,22.99 53.09,22.99 59.21,16.87 59.21,11.02 58.24,10.06 v57.81,10.06
  Bottom 0.508: LCD_CON.25 v24.13,24.77
LCD_D5  (via drill 0.4)
  Top 0.508: v57.91,9.27 58.93,9.27 LCD_TR.26
  Route2 0.203: v24.54,25.43 25.65,24.31 30.91,24.31 31.32,23.9 36.2,23.9 36.7,24.41 41.86,24.41 42.93,23.34 53.24,23.34 59.56,17.02 59.56,10.85 57.99,9.27 v57.91,9.27
  Bottom 0.508: LCD_CON.26 24.13,26.04 24.54,25.63 v24.54,25.43
LCD_D6  (via drill 0.4)
  Top 0.508: v57.1,8.26 LCD_TR.27
  Route2 0.203: v21.59,24.77 23.11,23.24 30.45,23.24 30.86,22.84 36.73,22.84 37.24,23.34 41.4,23.34 42.47,22.28 52.78,22.28 58.5,16.56 58.5,12.7 56.9,11.1 56.9,8.59 57.1,8.38 v57.1,8.26
  Bottom 0.508: LCD_CON.27 v21.59,24.77
LCD_D7  (via drill 0.4)
  Top 0.508: v57.94,8.26 LCD_TR.28
  Route2 0.203: v22.12,25.4 23.93,23.6 30.61,23.6 31.01,23.19 36.55,23.19 37.06,23.7 41.55,23.7 42.62,22.63 52.93,22.63 58.85,16.71 58.85,12.52 57.25,10.92 57.25,8.94 v57.94,8.26
  Bottom 0.508: LCD_CON.28 21.59,25.93 v22.12,25.4
LCD_D10  (via drill 0.4)
  Top 0.762: LCD_TR.15 LCD_TR.13 v57.12,17.14 LCD_TR.14
  Route15 0.203: v40.74,21.64 55.22,21.64 55.88,22.3 57.94,22.3 58.83,21.41 58.83,18.82 57.15,17.14 v57.12,17.14
  Bottom 0.508: LCD_CON.13 v40.74,21.64
  Bottom 1.016: LCD_CON.15 36.83,20.04 39.37,20.04 LCD_CON.13 | LCD_CON.13 | LCD_CON.13 LCD_CON.14
LCD_D11  (via drill 0.4)
  Top 0.508: v57.94,15.88 LCD_TR.16
  Route15 0.203: v36.83,24.97 38.33,24.97 41.3,22 54.99,22 55.65,22.66 58.06,22.66 59.18,21.54 59.18,17.12 v57.94,15.88
  Bottom 0.508: v36.83,24.97 LCD_CON.16
LCD_D12  (via drill 0.4)
  Top 0.508: v57.23,14.88 56.95,14.61 LCD_TR.17
  Route15 0.203: v33.86,24.64 33.86,24.54 36.12,22.28 38.71,22.28 40.26,20.73 55.47,20.73 56.34,21.59 57.4,21.59 57.66,21.34 57.66,20.6 56.19,19.13 56.19,15.93 v57.23,14.88
  Bottom 0.508: LCD_CON.17 34.29,23.37 33.86,23.8 v33.86,24.64
LCD_D13  (via drill 0.4)
  Top 0.508: v57.94,14.61 LCD_TR.18
  Route15 0.203: v34.59,24.64 36.6,22.63 38.91,22.63 40.46,21.08 55.24,21.08 56.11,21.95 57.76,21.95 58.47,21.23 58.47,19.13 57.2,17.86 56.9,17.86 56.54,17.5 56.54,16.43 57.94,15.04 v57.94,14.61
  Bottom 0.508: LCD_CON.18 34.29,25.96 34.59,25.65 v34.59,24.64
LCD_D14  (via drill 0.4)
  Top 0.508: v57.15,13.34 LCD_TR.19
  Bottom 0.203: v57.15,13.34 51.77,18.72 32.44,18.72 31.75,19.41
  Bottom 1.016: 31.75,19.41 LCD_CON.19
LCD_D15  (via drill 0.4)
  Top 0.508: v57.94,13.34 LCD_TR.20
  Bottom 0.203: v57.94,13.34 52.2,19.07 33.5,19.07 32.89,19.68 32.89,24.77 31.75,25.91
  Bottom 1.016: 31.75,25.91 LCD_CON.20
LCD_D18  (via drill 0.4)
  Top 0.508: v51,24.61 51,24.33 53.11,22.23
  Top 0.762: LCD_TR.5 LCD_TR.7 | LCD_TR.5 LCD_TR.6 | 53.11,22.23 LCD_TR.5
  Bottom 0.508: 49.53,24.61 v51,24.61
  Bottom 1.016: LCD_CON.7 46.99,20.04 49.53,20.04 LCD_CON.5 49.53,24.61 LCD_CON.6
LCD_D19  (via drill 0.4)
  Top 0.254: 60.33,21.39 60.45,21.51 60.45,25.65 v60.2,25.91
  Top 0.508: 60.33,21.39 59.89,20.95 LCD_TR.8
  Bottom 0.203: 47.62,30.1 47.78,30.25 55.37,30.25 55.63,30 55.63,28.42 57.63,26.42 59.69,26.42 v60.2,25.91
  Bottom 0.508: LCD_CON.8 46.99,29.46 47.62,30.1
LCD_D20  (via drill 0.3, 0.4)
  Top 0.508: v57.86,20.09 57.4,20.09 57,19.68 LCD_TR.9
  Route2 0.203: v48.54,24.26 48.67,24.26 48.87,24.05 53.57,24.05 55.73,21.89 57.3,21.89 57.86,21.34 v57.86,20.09
  Bottom 0.254: 45.26,23.5 46.02,24.26 v48.54,24.26
  Bottom 0.508: LCD_CON.9 44.45,23.5 45.26,23.5
LCD_D21  (via drill 0.3, 0.4)
  Top 0.508: v60.33,19.94 60.07,19.68 LCD_TR.10
  Route2 0.203: v43.26,27.25 48.41,27.25 49.58,26.09 54.18,26.09 v60.33,19.94
  Bottom 0.508: LCD_CON.10 44.45,27.25 v43.26,27.25
LCD_D22  (via drill 0.3, 0.4)
  Top 0.508: v57.86,19.43 56.84,18.41 LCD_TR.11
  Route2 0.203: v44.53,24.28 45.11,23.7 53.39,23.7 55.55,21.54 57.1,21.54 57.51,21.13 57.51,20.47 57.35,20.32 57.35,19.86 57.78,19.43 v57.86,19.43
  Bottom 0.254: 43.18,24.21 44.45,24.21 v44.53,24.28
  Bottom 0.508: LCD_CON.11 41.91,22.94 43.18,24.21
LCD_D23  (via drill 0.3, 0.4)
  Top 0.508: v60.33,18.41 LCD_TR.12
  Route2 0.203: v42.88,26.59 48.54,26.59 49.4,25.73 53.98,25.73 58.42,21.29 58.42,20.32 v60.33,18.41
  Bottom 0.508: LCD_CON.12 41.91,26.59 v42.88,26.59
LCD_DE  (via drill 0.4)
  Top 0.508: LCD_TR.32 57.86,5.71 v57.53,6.04
  Route2 0.203: v16.51,24.77 16.51,24.26 19.56,21.21 36.7,21.21 37.77,22.28 40.95,22.28 42.01,21.21 52.32,21.21 55.83,17.7 55.83,6.96 56.26,6.53 57.05,6.53 v57.53,6.04
  Bottom 0.508: v16.51,24.77 LCD_CON.32
LCD_HSYNC  (via drill 0.4)
  Top 0.508: v56.52,7.09 55.22,7.09 LCD_TR.29
  Route2 0.203: v19.94,21.84 20.19,21.59 36.55,21.59 37.59,22.63 41.1,22.63 42.16,21.57 52.48,21.57 56.19,17.86 56.19,7.42 v56.52,7.09
  Bottom 0.508: LCD_CON.29 19.05,21.84 v19.94,21.84
LCD_VSYNC  (via drill 0.4)
  Top 0.508: v57.51,6.99 LCD_TR.30
  Route2 0.203: v19.05,24.77 21.84,21.97 36.4,21.97 37.41,22.99 41.25,22.99 42.32,21.92 52.63,21.92 56.54,18.01 56.54,7.95 v57.51,6.99
  Bottom 0.508: v19.05,24.77 LCD_CON.30
LRADC  (via drill 0.3)
  Top 0.508: v4.72,5.13 5.31,5.71 GPIO-2.9
  Route2 0.203: v4.72,5.13 5,4.85 7.34,4.85 8.13,4.06 15.24,4.06 15.49,3.81 17.78,3.81 18.16,3.43 20.07,3.43 20.45,3.05 22.4,3.05 22.81,2.64 24.71,2.64 25.07,2.29 27.18,2.29 28.19,1.27
  Route2 0.762: 28.19,1.27 LRADC.P$1
MICIN1  (via drill 0.3)
  Top 0.508: GPIO-2.4 v3.05,1.91
  Route2 0.203: 18.09,1.27 17.07,2.29 14.96,2.29 14.61,2.64 8.33,2.64 7.67,1.98 3.25,1.98 3.17,1.91 v3.05,1.91
  Route2 0.762: 18.09,1.27 MICIN1.P$1
N$1
  Top 0.203: 14.54,13.15 14.1,12.7 13.59,12.7 12.8,11.91 12.8,9.42 13.59,8.64
  Top 0.254: R18.2 15.62,2.54 12.7,2.54 12.32,2.92 12.32,3.56 12.06,3.56 13.59,5.08 13.59,8.64 | 14.54,13.15 FET1.1
  Top 0.762: D1.A 12.06,3.56
  Top 1.016: D1.A 9.91,3.56 8.89,2.54 +5V.P$1
N$2  (via drill 0.6)
  Top 0.508: WIFI_E.2 22.86,15.24 22.99,15.24
  Top 0.762: v22.86,14.73 22.86,15.24
  Top 1.016: FET2.3 22.99,15.24
  Bottom 1.016: C12.1 14.61,14.48 15.72,13.36 16.51,13.36 U3.5 17.57,13.16 17.78,12.95 21.08,12.95 v22.86,14.73
N$16  (via drill 0.6)
  Top 0.508: 9.4,9.62 U2.1
  Top 1.016: R4.2 9.27,8.64 9.4,8.76 9.4,9.62 v9.4,10.67
  Route15 1.016: v9.4,10.67 10.41,9.65 12.06,9.65 12.7,10.29 v13.51,10.29
  Bottom 1.016: L2.2 12.32,8.89 12.32,10.29 | C8.1 C7.1 C6.1 C5.1 12.32,10.29 | v13.51,10.29 12.32,10.29
N$64
  Top 0.508: U1.3 16.57,5.84 16.94,5.84
  Top 1.27: 16.94,5.84 18.48,5.84 L1.1
N$65
  Top 0.508: 20.57,15.24 3.3V_E.1
  Top 1.016: L1.2 20.57,5.71 C2.1 R1.1 C4.1 C3.1 20.57,15.24
N$66  (via drill 0.4)
  Top 0.508: U1.5 14.73,8.41 14.73,9.02
  Top 0.762: v18.87,9.4 18.8,9.4 | 14.73,9.27 v13.97,9.27
  Top 1.016: R1.2 18.8,9.4 C2.2 | 14.73,9.02 14.73,9.27 R2.1
  Route15 0.508: v13.97,9.27 16.51,9.27 16.64,9.4 v18.87,9.4
N$99
  Top 0.508: U2.3 11.74,8.7 12.32,8.13 R6.2
N$124
  Top 0.254: U5.19 33.98,26.75 34.42,27.18
  Top 0.508: 34.42,27.18 C16.2
  Top 1.016: C16.2 R11.2
N$129
  Bottom 0.508: PWR_LED.A 2.16,3.68 4.06,3.68 4.57,3.17 4.57,2.29 5.46,1.4 R3.2
N$266
  Bottom 1.016: USB_OTG.GND2 USB_OTG.GND1 1.91,7.24 1.91,17.14 USB_OTG.GND3 USB_OTG.GND4 6.54,17.27 L3.2
NAND_CEN
  Top 0.254: R9.2 36.2,20.95 36.2,19.68 36.58,19.3 | U5.9 34.45,21.75 34.54,21.84
  Top 0.508: 36.58,19.3 #CE_NAND_E.1 | 34.54,21.84 R9.2
NMI_N  (via drill 0.4)
  Top 0.508: GPIO-1.4 v3.05,9.53
  Route2 0.203: v3.05,9.53 3.05,8.56 3.43,8.18 8.87,8.18 10.16,6.88 14.28,6.88 16.92,4.24 17.93,4.24 18.36,3.81 20.32,3.81 20.7,3.43 22.55,3.43 22.99,3 24.87,3 25.22,2.64 27.36,2.64 27.71,2.29 32.23,2.29 33.25,1.27
  Route2 0.762: 33.25,1.27 NMI.P$1
PIN4/TWI0-SCK  (via drill 0.3, 0.4)
  Top 0.508: GPIO-1.5 4.98,10.79 4.8,10.97 v4.5,10.97 | v24.89,4.57 24.51,4.57 R15.1
  Route15 0.203: 35.79,1.27 34.77,2.29 33.1,2.29 32.74,2.64 26.82,2.64 v24.89,4.57 17.42,4.57 15.21,6.78 10.24,6.78 9.2,7.82 6.78,7.82 5,9.6 5,10.46 v4.5,10.97
  Route15 0.762: 35.79,1.27 PIN4.P$1
PIN5/TWI0-SDA  (via drill 0.3, 0.4)
  Top 0.508: v4.55,12.09 5.82,12.09 GPIO-1.7 | v27.43,4.57 27.05,4.57 R14.1
  Route15 0.203: 40.89,1.27 39.88,2.29 35.31,2.29 34.95,2.64 33.27,2.64 32.87,3.05 28.96,3.05 v27.43,4.57 26.92,5.08 17.42,5.08 15.37,7.14 10.44,7.14 9.4,8.18 6.93,8.18 5.51,9.6 5.51,11.12 v4.55,12.09
  Route15 0.762: 40.89,1.27 PIN5.P$1
PIN6/PWM0  (via drill 0.4)
  Top 0.203: 6.86,13.72 7.37,14.22 7.37,15.39 8.51,16.54 13.61,16.54 15.49,18.41 v15.49,20.34
  Top 0.508: GPIO-1.9 6.48,13.34 6.86,13.72 | v57.89,3.28 59.08,3.28 LCD_TR.36
  Route2 0.203: v15.49,20.34 15.65,20.34 15.85,20.14 51.87,20.14 54.69,17.32 54.69,6.4 57.81,3.28 v57.89,3.28
  Bottom 0.254: 12.62,30.38 14.83,30.38 15.49,29.72 v15.49,20.34
  Bottom 0.508: 12.62,30.38 11.43,29.18 LCD_CON.36
PIN7  (via drill 0.4)
  Top 0.203: 6.86,14.96 7.01,15.11 7.01,15.54 8.36,16.89 13.39,16.89 14.86,18.36 v14.86,20.95
  Top 0.508: GPIO-1.11 6.5,14.61 6.86,14.96 | v56.77,5.13 56.69,5.13 56.01,4.45 LCD_TR.33
  Route2 0.203: v14.86,20.95 15.7,20.95 16.15,20.5 52.02,20.5 55.07,17.45 55.07,6.53 56.36,5.23 56.67,5.23 v56.77,5.13
  Bottom 0.508: LCD_CON.33 13.97,20.95 v14.86,20.95
PIN8  (via drill 0.4)
  Top 0.203: 6.86,16.18 7.92,17.25 9.63,17.25 v10.92,18.54
  Top 0.254: 58.12,4.45 56.21,2.54 53.92,2.54 v53.82,2.44
  Top 0.508: GPIO-1.13 6.55,15.88 6.86,16.18 | 58.12,4.45 LCD_TR.34
  Route2 0.203: v10.92,18.54 13.87,18.54 14.4,18.01 50.88,18.01 52.4,16.48 52.4,5.54 53.31,4.62 53.31,2.95 v53.82,2.44
  Bottom 0.254: v10.92,18.54 11.43,19.05 12.06,19.05 12.7,19.68 12.7,24.89
  Bottom 0.508: LCD_CON.34 13.97,26.16 12.7,24.89
PIN9  (via drill 0.4)
  Top 0.203: 6.96,17.14 7.42,17.6 8.97,17.6 v10.13,18.77
  Top 0.508: GPIO-1.15 6.96,17.14 | v53.87,3.17 LCD_TR.35
  Route2 0.203: v10.13,18.77 10.46,19.1 13.84,19.1 14.58,18.36 51.1,18.36 52.78,16.69 52.78,5.69 53.87,4.6 v53.87,3.17
  Bottom 0.508: LCD_CON.35 11.43,20.07 v10.13,18.77
PIN10/TWI1-SCK  (via drill 0.3, 0.4)
  Top 0.203: v4.55,15.34 4.67,15.47 4.67,17.96 4.7,17.98
  Top 0.254: GPIO-1.17 5.13,18.41 4.7,17.98
  Top 0.508: v29.97,4.57 29.59,4.57 R17.1
  Route15 0.203: 48.59,1.27 47.57,2.29 40.46,2.29 40.11,2.64 35.43,2.64 35.08,3 33.53,3 33.05,3.48 31.06,3.48 v29.97,4.57 29.11,5.44 17.58,5.44 15.52,7.49 10.57,7.49 9.53,8.53 7.11,8.53 5.97,9.68 5.97,13.92 v4.55,15.34
  Route15 0.762: 48.59,1.27 PIN10.P$1
PIN11/TWI1-SDA  (via drill 0.3, 0.4)
  Top 0.203: v3.83,15.65 4.32,16.13 4.32,18.19 4.7,18.57 4.7,19.33
  Top 0.508: GPIO-1.19 5.05,19.68 4.7,19.33 | v32.51,4.57 32.13,4.57 R16.1
  Route15 0.203: v3.83,15.65 4.09,15.9 4.83,15.9 6.33,14.4 6.33,9.83 7.26,8.89 9.7,8.89 10.74,7.85 15.67,7.85 17.73,5.79 31.29,5.79 v32.51,4.57 33.73,3.35 35.23,3.35 35.59,3 40.34,3 40.69,2.64 47.78,2.64 48.13,2.29 50.11,2.29 51.13,1.27
  Route15 0.762: 51.13,1.27 PIN11.P$1
PIN12/NWE/SPI0_MOSI  (via drill 0.4)
  Top 0.254: U4.5 38.99,27.94 38.1,27.05 38.1,26.67 37.67,26.25 U5.18 30.64,26.25 v30.2,25.81
  Top 0.508: GPIO-1.21 6.66,20.95 v7.29,21.59
  Route15 0.203: v7.29,21.59 6.76,22.12 6.76,23.8 7.01,24.05 10.41,24.05 10.57,24.21 28.6,24.21 v30.2,25.81
PIN13/NALE/SPI0_MISO  (via drill 0.4)
  Top 0.254: U5.17 31.33,25.75 v30.86,25.27
  Top 0.508: U4.2 44.83,25.4 v44.7,25.27 | GPIO-1.23 5.92,22.3 v7.57,22.3
  Route15 0.203: v7.57,22.3 8.51,23.24 10.64,23.24 10.9,23.5 29.59,23.5 30.86,24.77 v30.86,25.27
  Route15 0.254: v30.86,25.27 33.1,27.51 41.1,27.51 42.65,25.96 44.02,25.96 v44.7,25.27
PIN14/NCLE/SPI0_CLK  (via drill 0.4)
  Top 0.254: U4.6 39.75,26.42 38.56,26.42 37.97,25.83 34.34,25.83 33.75,25.25 U5.16 32.08,25.25 31.52,24.69 30.4,24.69 v30.2,24.89
  Top 0.508: GPIO-1.25 v7.32,23.5
  Route15 0.203: v7.32,23.5 7.42,23.5 7.54,23.62 10.49,23.62 10.72,23.85 29.16,23.85 v30.2,24.89
PIN15/NCE1/SPI0_CS0  (via drill 0.4)
  Top 0.406: v48.46,25.86 48.46,25.12 47.47,24.13 U4.1
  Top 0.508: GPIO-1.27 6.6,24.77 6.68,24.69 v7.11,24.69
  Top 1.016: U4.1 46.35,21.34 45.47,20.45 R10.2
  Route15 0.203: v7.11,24.69 7.95,25.53 10.34,25.53 12.01,27.2 28.14,27.2 29.21,28.27 34.29,28.27 43.08,28.27 45.49,25.86 v48.46,25.86
  Route15 0.762: 34.29,28.27 PIN15.P$1
PIN16/NCE0  (via drill 0.4)
  Top 0.254: v27.66,22.53 27.66,21.34 31.77,17.22 33.93,17.22 35.38,18.67
  Top 0.508: v4.52,26.04 GPIO-1.29 | 35.38,18.67 #CE_NAND_E.2
  Route15 0.203: v4.52,26.04 4.57,25.98 4.57,22.99 6.88,20.68 7.77,20.68 9.58,22.48 27.61,22.48 v27.66,22.53
PIN17/NRE  (via drill 0.4)
  Top 0.254: v30.35,22.53 31.64,21.25 U5.8
  Top 0.508: v4.52,27.3 GPIO-1.31
  Route15 0.203: v4.52,27.3 5.08,26.75 5.08,22.99 7.04,21.03 7.57,21.03 9.4,22.86 10.79,22.86 11.02,23.09 29.79,23.09 v30.35,22.53
PIN18/NRB0  (via drill 0.3, 0.4)
  Top 0.203: 6.78,28.57 6.99,28.57 7.37,28.19 7.37,27.94 7.49,27.81 7.49,27.43 8.76,26.16 9.78,26.16 v9.91,26.04
  Top 0.254: 34.54,20.32 34.12,20.75 U5.7 31.32,20.75 25.91,26.16 v25.4,26.16
  Top 0.508: 34.54,20.32 R8.2 | 6.78,28.57 GPIO-1.33
  Route2 0.203: v9.91,26.04 10.03,26.16 v25.4,26.16
PIN19/NRB1  (via drill 0.3)
  Top 0.203: 6.86,29.84 8.13,28.57 8.13,28.19 8.26,28.07 8.26,27.69 9.02,26.92 v10.54,26.92
  Top 0.508: GPIO-1.35 6.86,29.84
  Route15 0.203: v10.54,26.92 11.18,27.56 27.56,27.56 31.09,31.09
  Route15 0.762: 31.09,31.09 PIN19.P$1
PIN20/NDQ0
  Top 0.203: U5.29 12,27.25 11.81,27.43 11.81,29.36 10.59,30.58 7.64,30.58 7.11,31.11
  Top 0.508: GPIO-1.37 7.11,31.11
PIN21/NDQ1
  Top 0.203: U5.30 11.91,26.75 11.43,27.23 11.43,29.21 10.41,30.23 7.37,30.23 7.11,30.48 4.83,30.48 4.57,30.73 4.57,32.13 4.83,32.38
  Top 0.508: 4.83,32.38 GPIO-1.39
PIN22/NDQ2
  Top 0.203: 2.69,31.98 3.05,31.62 3.05,30.99 4.83,29.21 6.86,29.21 7.75,28.32 7.75,28.07 7.87,27.94 7.87,27.56 8.89,26.54 10.16,26.54 10.46,26.25 U5.31
  Top 0.508: GPIO-1.40 2.29,32.38 2.69,31.98
PIN23/NDQ3
  Top 0.203: U5.32 10.45,25.75 10.24,25.53 8.89,25.53 7.11,27.3 7.11,27.69 6.86,27.94 4.83,27.94 3.96,28.8 3.96,29.44
  Top 0.254: GPIO-1.38 2.29,31.11 3.96,29.44
PIN24/NDQ4
  Top 0.203: U5.41 10.83,21.25 10.54,20.95 9.78,20.95 9.27,21.46 9.27,24.64 7.24,26.67 4.32,26.67 3.96,27.03 3.96,28.19 2.69,29.46
  Top 0.508: GPIO-1.36 2.31,29.84 2.69,29.46
PIN25/NDQ5
  Top 0.203: U5.42 10.89,20.75 10.74,20.6 9.63,20.6 8.89,21.34 8.89,23.37 7.75,24.51 7.75,24.92 7.26,25.4 4.27,25.4 3.61,26.06 3.61,27.38 2.69,28.3
  Top 0.508: GPIO-1.34 2.41,28.57 2.69,28.3
PIN26/NDQ6
  Top 0.203: 2.69,27.03 3.25,26.47 3.25,25.63 4.75,24.13 7.49,24.13 8.51,23.11 8.51,21.21 9.47,20.25 U5.43
  Top 0.508: GPIO-1.32 2.41,27.3 2.69,27.03
PIN27/NDQ7
  Top 0.203: 2.69,25.63 4.45,23.88 4.45,23.19 4.78,22.86 7.87,22.86 8.13,22.61 8.13,21.08 9.46,19.75 U5.44
  Top 0.508: GPIO-1.30 2.29,26.04 2.69,25.63
PIN28/NDQS  (via drill 0.3, 0.4)
  Top 0.254: 2.79,24.77 v3.94,23.62
  Top 0.508: GPIO-1.28 2.79,24.77 | FET2.1 26.43,14.22 v25.4,14.22
  Top 1.016: FET2.1 26.56,14.35 R19.2
  Route15 0.203: v3.94,23.62 3.94,27.56 4.32,27.94 22.61,27.94 v22.86,28.19 25.65,28.19 28.55,31.09
  Route15 0.762: 28.55,31.09 PIN28.P$1
  Bottom 0.203: v22.86,28.19 22.86,18.92 25.4,16.38 v25.4,14.22
PIN29  (via drill 0.3)
  Top 0.508: GPIO-1.26 3.17,23.5 v3.3,23.37
  Route15 0.203: v3.3,23.37 3.3,27.56 4.06,28.32 22.1,28.32 22.61,28.83 23.75,28.83 26.01,31.09
  Route15 0.762: 26.01,31.09 PIN29.P$1
PIN30  (via drill 0.3)
  Top 0.508: GPIO-1.24 2.54,22.23 2.79,22.48 v3.05,22.48
  Route15 0.203: v3.05,22.48 2.79,22.73 2.79,27.69 3.81,28.7 21.08,28.7 23.47,31.09
  Route15 0.762: 23.47,31.09 PIN30.P$1
PIN31  (via drill 0.3)
  Top 0.508: GPIO-1.22 1.85,21.03 2.62,21.03 v3.17,21.59
  Route15 0.203: v3.17,21.59 2.41,22.35 2.41,27.94 3.56,29.08 18.92,29.08 20.93,31.09
  Route15 0.762: 20.93,31.09 PIN31.P$1
PIN32  (via drill 0.3)
  Top 0.203: GPIO-1.20 2.44,19.68 2.69,19.94 3.4,19.94 3.83,20.37 v3.83,21.08
  Route15 0.203: 18.39,31.09 16.76,29.46 3.3,29.46 2.03,28.19 2.03,21.97 2.92,21.08 v3.83,21.08
  Route15 0.762: 18.39,31.09 PIN32.P$1
PIN33  (via drill 0.3)
  Top 0.203: 0.84,18.41 0.51,18.75 0.51,20.07 0.76,20.32 2.92,20.32 v3.17,20.57
  Top 0.508: GPIO-1.18 0.84,18.41
  Route15 0.203: 15.85,31.09 14.61,29.84 3.05,29.84 1.65,28.45 1.65,21.72 2.79,20.57 v3.17,20.57
  Route15 0.762: 15.85,31.09 PIN33.P$1
PIN34  (via drill 0.3)
  Top 0.203: 2.67,17.53 3.02,17.88 3.02,19.18 3.17,19.33 v3.17,19.43
  Top 0.508: GPIO-1.16 2.29,17.14 2.67,17.53
  Route15 0.203: v3.17,19.43 1.27,21.34 1.27,28.7 2.79,30.23 12.45,30.23 13.31,31.09
  Route15 0.762: 13.31,31.09 PIN34.P$1
PIN35  (via drill 0.3)
  Top 0.203: 2.74,15.88 3.53,16.66 v3.53,18.9
  Top 0.508: GPIO-1.14 2.74,15.88
  Route15 0.203: 10.77,31.09 10.29,30.61 2.54,30.61 0.89,28.96 0.89,20.95 2.95,18.9 v3.53,18.9
  Route15 0.762: 10.77,31.09 PIN35.P$1
PIN36  (via drill 0.3)
  Top 0.203: 2.82,14.61 3.28,15.06 3.28,15.85 3.94,16.51 3.94,18.54 v4.19,18.8
  Top 0.508: GPIO-1.12 2.82,14.61
  Route15 0.203: 7.92,31.75 7.16,30.99 2.29,30.99 0.51,29.21 0.51,20.57 2.69,18.39 3.79,18.39 v4.19,18.8
  Route15 0.762: 7.92,31.75 PIN36.P$1
PIN37/LED1  (via drill 0.4)
  Top 0.508: GPIO-1.10 2.62,13.34 2.87,13.08 v3.02,13.08
  Route2 0.203: 45.95,1.27 44.93,2.29 42.95,2.29 42.6,2.64 38.05,2.64 37.69,3 33.12,3 32.77,3.35 28.17,3.35 27.81,3.71 25.7,3.71 25.35,4.06 23.44,4.06 22.94,4.57 21.34,4.57 20.95,4.95 19.13,4.95 18.77,5.31 17.37,5.31 14.73,7.95 10.72,7.95 5.59,13.08 v3.02,13.08
  Route2 0.762: 45.95,1.27 PIN37.P$1
PIN38/VGA_DIS  (via drill 0.4)
  Top 0.508: GPIO-1.8 v3.17,12.06
  Route2 0.203: 43.43,1.27 42.42,2.29 37.87,2.29 37.52,2.64 32.94,2.64 32.59,3 28.02,3 27.66,3.35 25.53,3.35 25.17,3.71 23.29,3.71 22.81,4.19 21.16,4.19 20.78,4.57 18.87,4.57 18.49,4.95 17.22,4.95 14.58,7.59 10.52,7.59 9.09,9.02 7.34,9.02 6.63,9.73 6.63,10.9 4.88,12.65 3.76,12.65 v3.17,12.06
  Route2 0.762: 43.43,1.27 PIN38.P$1
PIN39/USBH_EN  (via drill 0.4)
  Top 0.508: GPIO-1.6 2.54,10.79 2.79,11.05 v3.05,11.05
  Route2 0.203: v3.05,11.05 3.53,11.53 4.72,11.53 5.61,10.64 5.61,9.5 6.55,8.56 8.99,8.56 10.31,7.24 14.45,7.24 17.09,4.6 18.21,4.6 18.62,4.19 20.57,4.19 20.95,3.81 22.68,3.81 23.14,3.35 25.02,3.35 25.38,3 27.51,3 27.86,2.64 32.38,2.64 32.74,2.29 37.29,2.29 38.3,1.27
  Route2 0.762: 38.3,1.27 PIN39.P$1
RESET_N  (via drill 0.3)
  Top 0.508: GPIO-1.3 5.21,9.53 v4.7,9.02
  Route15 0.203: v4.7,9.02 5.05,9.02 6.6,7.47 9.04,7.47 10.08,6.43 15.06,6.43 17.3,4.19 24.41,4.19 26.31,2.29 29.67,2.29 30.68,1.27
  Route15 0.762: 30.68,1.27 RST.P$1
SPI2_CLK  (via drill 0.4)
  Top 0.254: 53.98,31.11 53.03,30.18 v53.03,28.75
  Top 0.508: 53.98,31.11 GPIO-3.3
  Route15 0.203: 40.41,31.75 41.78,30.38 45.8,30.38 46.86,29.31 52.48,29.31 v53.03,28.75
  Route15 0.762: CLK2.P$1 40.41,31.75
SPI2_CS0  (via drill 0.3)
  Top 0.203: 56.24,32.13 56.24,31.65 57.17,30.71 v57.17,29.77
  Top 0.508: GPIO-3.1 55.98,32.38 56.24,32.13
  Route15 0.203: v57.17,29.77 57.17,29.23 56.13,28.19 52.81,28.19 52.05,28.96 46.66,28.96 45.59,30.02 39.57,30.02 37.85,31.75
  Route15 0.762: SPI2_CS0.P$1 37.85,31.75
SPI2_MISO  (via drill 0.3)
  Top 0.508: GPIO-3.7 55.75,28.57 v56.26,29.08
  Route15 0.203: 45.52,31.75 47.24,30.02 55.32,30.02 v56.26,29.08
  Route15 0.762: MISO2.P$1 45.52,31.75
SPI2_MOSI  (via drill 0.4)
  Top 0.508: GPIO-3.5 54.3,29.84 53.8,29.34 v53.62,29.34
  Route15 0.203: 43,31.75 44.02,30.73 46,30.73 47.07,29.67 53.19,29.67 53.52,29.34 v53.62,29.34
  Route15 0.762: MOSI2.P$1 43,31.75
TPX1  (via drill 0.4)
  Top 0.508: v56.36,1.91 LCD_TR.37
  Route2 0.203: v8.05,20.19 8.43,19.81 14.2,19.81 14.94,19.07 51.41,19.07 53.54,16.94 53.54,5.97 56.36,3.15 v56.36,1.91
  Bottom 0.508: LCD_CON.37 8.89,20.19 v8.05,20.19
TPX2  (via drill 0.4)
  Top 0.508: v57.28,2.79 58.06,2.01 59.08,2.01 LCD_TR.38
  Route2 0.203: v8.51,24.61 9.25,23.88 11.18,23.88 15.27,19.79 51.71,19.79 54.3,17.2 54.3,6.27 57.28,3.3 v57.28,2.79
  Bottom 0.508: LCD_CON.38 8.89,24.99 v8.51,24.61
TPY1  (via drill 0.4)
  Top 0.508: v53.87,0.69 53.92,0.64 LCD_TR.39
  Route2 0.203: v7.21,19.68 7.32,19.68 7.54,19.46 14.02,19.46 14.76,18.72 51.26,18.72 53.16,16.82 53.16,5.84 54.43,4.57 54.43,1.25 v53.87,0.69
  Bottom 0.508: LCD_CON.39 6.35,19.68 v7.21,19.68
TPY2  (via drill 0.3, 0.4)
  Top 0.508: v57.84,0.64 LCD_TR.40
  Route2 0.203: v7.19,25.96 7.75,25.4 7.75,24.54 8.76,23.52 11,23.52 15.09,19.43 51.56,19.43 53.92,17.07 53.92,6.12 56.72,3.33 56.72,2.59 57.15,2.16 57.4,2.16 57.86,1.7 57.86,0.66 v57.84,0.64
  Bottom 0.508: LCD_CON.40 6.35,25.96 v7.19,25.96
TWI2_SCK  (via drill 0.3)
  Top 0.508: v57.91,28.96 58.29,28.57 GPIO-3.8
  Top 1.016: R12.1 TWI2_SCK.P$1
  Route15 0.203: 50.19,31.09 50.55,30.73 56.92,30.73 57.91,29.74 v57.91,28.96
  Route15 0.762: TWI2_SCK.P$1 50.19,31.09
TWI2_SDA  (via drill 0.3)
  Top 0.508: v57.91,26.92 58.29,27.3 GPIO-3.10
  Top 1.016: R13.1 TWI2_SDA.P$1
  Bottom 0.203: 53.37,31.75 54.13,30.99 58.12,30.99 58.42,30.68 58.42,27.43 v57.91,26.92
  Bottom 1.016: TWI2_SDA.P$1 53.37,31.75
UBOOT  (via drill 0.3)
  Top 0.203: 56.24,27.66 56.39,27.81 56.39,28.32 56.77,28.7 56.77,29.46 v56.52,29.72
  Top 0.508: GPIO-3.9 55.88,27.3 56.24,27.66
  Route15 0.203: v56.52,29.72 55.85,30.38 48.36,30.38 47.65,31.09
  Route15 0.762: UBOOT.P$1 47.65,31.09
UDM0  (via drill 0.3)
  Top 0.203: GPIO-2.3 6.27,1.91 6.86,1.32 7.16,1.32 7.32,1.47 7.32,2.88 8.08,3.65 8.08,9.23 8.18,9.34 8.18,10.72 8,10.9 7.29,10.9 7.16,11.02 7.16,11.25 7.29,11.38 v8.26,11.38
  Bottom 0.508: v8.26,11.38 8.24,11.39 USB_OTG.D-
UDM1  (via drill 0.3)
  Top 0.508: GPIO-2.7 6.93,4.45 v7.04,4.34
  Bottom 0.203: U3.4 16.37,11.16 15.47,10.26 15.47,8.85 12.9,6.29 12.9,5.27 11.82,4.19 7.19,4.19 v7.04,4.34
UDP0  (via drill 0.3)
  Top 0.203: GPIO-2.1 6.1,0.89 7.35,0.89 7.75,1.28 7.75,2.69 8.51,3.45 8.51,9.04 8.61,9.14 8.61,10.95 8.84,11.18 v8.84,11.81
  Bottom 0.508: USB_OTG.D+ 7.8,12.19 7.85,12.14 8.51,12.14 v8.84,11.81
UDP1  (via drill 0.3)
  Top 0.508: GPIO-2.5 6.6,3.17 v7.04,3.61
  Bottom 0.203: U3.3 16.4,9.16 13.34,6.1 13.34,5.08 12.01,3.76 7.19,3.76 v7.04,3.61
USB0-DRV
  Top 0.203: 12.98,14.5 13.08,14.61 13.08,15.42 15.42,17.75 30.66,17.75 31.57,16.84 35.99,16.84 38.71,19.56 46.38,19.56 49.99,23.16 49.99,25.22 50.93,26.16 56.39,26.16 57.86,27.64 57.86,28.25 57.4,28.7 57.4,29.21 58.04,29.84
  Top 0.406: R5.2 12.98,14.5 | 58.04,29.84 GPIO-3.6
  Top 0.508: U2.4 11.74,12.76 12.32,13.34
  Top 1.016: 12.32,13.34 R5.2
USB0-IDDET  (via drill 0.3)
  Top 0.508: v57.91,30.45 57.91,30.68 58.34,31.11 GPIO-3.4
  Bottom 0.203: 5.58,12.99 5.21,13.36 5.21,14.86 6.17,15.82 8.81,15.82 9.12,16.13 11.18,16.13 11.43,16.38 11.43,18.21 11.76,18.54 16.76,18.54 18.03,19.81 18.03,30.1 18.54,30.61 55.6,30.61 55.75,30.45 v57.91,30.45
  Bottom 0.508: USB_OTG.ID 5.58,12.99
USB0-VBUSDET
  Top 0.203: 10.79,5.21 10.79,5.08 11.3,4.57 12.45,4.57 13.21,5.33 13.21,8.38 12.39,9.2 12.39,12.01 13.44,13.06 13.44,15.16 15.67,17.4 30.48,17.4 31.39,16.48 36.22,16.48 38.91,19.18 46.58,19.18 50.39,22.99 50.39,25.12 51.05,25.78 57.91,25.78 58.67,26.54 60.07,26.54 60.45,26.92 60.45,31.75 60.12,32.08
  Top 0.508: GPIO-3.2 59.82,32.38 60.12,32.08
  Top 0.762: R7.2 10.79,5.21
  Top 1.016: R4.1 R7.2
VCC  (via drill 0.5, 0.6)
  Top 0.254: U5.37 12.07,23.25 11.68,22.86 | 37.08,22.73 34.42,22.73 33.91,23.25 U5.12
  Top 0.508: 20.83,16.51 3.3V_E.2 | C14.2 11.3,22.86 11.68,22.86 | v32.64,6.48 33.27,5.84 33.27,3.68 32.77,3.17 R16.2 | 22.86,16.51 WIFI_E.1
  Top 0.762: GPIO-1.1 6.55,8.26 7.37,7.44 v7.37,5.59 | U4.3 44.2,26.67 42.29,24.77 | R11.1 v37.97,29.59
  Top 1.016: v18.8,15.37 18.8,15.62 19.68,16.51 20.83,16.51 22.86,16.51 26.18,16.51 FET2.2 26.56,16.13 R19.1 | 42.29,20.42 R10.1 | 42.29,20.42 C13.1 42.29,24.13 | U4.7 U4.8 42.29,24.13 | 42.29,24.13 42.29,24.77 | 37.08,21.57 R9.1 37.08,22.73 C15.2 | 37.08,21.57 R8.1 | v10.16,21.72 C14.2 | v52.07,24.89 52.07,24.64 53.21,23.5 LCD_TR.3 | 37.08,21.57 v38.1,21.57 38.28,21.57 39.42,20.42 42.29,20.42 | R12.2 49.66,28.19 v50.8,28.19 51.94,28.19 R13.2 | R15.2 R14.2 R17.2 R16.2
  Route2 1.016: v18.8,15.37 10.41,15.37 8.89,16.89 v8.89,18.54
  Route15 0.889: 10.16,21.59 v10.16,21.72
  Route15 1.016: v8.89,18.54 8.89,19.3 10.16,20.57 10.16,21.59
  Bottom 1.016: LCD_CON.3 v52.07,24.89
  pour Route15 (isolate 0.305, rank 5): -10.16,-10.16 33.53,-10.16 33.53,10.41 39.37,10.41 39.37,17.78 50.8,17.78 50.8,-10.16 71.12,-10.16 71.12,43.18 -10.16,43.18
VMIC  (via drill 0.3)
  Top 0.508: GPIO-2.2 v3.07,0.64
  Route2 0.203: 15.47,1.27 14.45,2.29 8.48,2.29 6.73,0.53 3.3,0.53 3.2,0.64 v3.07,0.64
  Route2 0.762: 15.47,1.27 VMIC.P$1
(copper drawn outside any net)
  shapes: Bottom area x12

### Text on the board
Top: 41 errors | 49 total errors | 4 layer PCB
Bottom: 8 errors
tNames: 1 | 2 | + | RoHS Compliant | A13-SOM-WIFI | (C)2014 | https://www.olimex.com | 2 | 1
bNames: A13-SOM-WIFI | https://www.olimex.com | Made in Bulgaria, 2014 | Rev.B | Designed by: